# EAGLE design nas (EAGLE 7.7.0)

## Sheet 1 of 4: Power
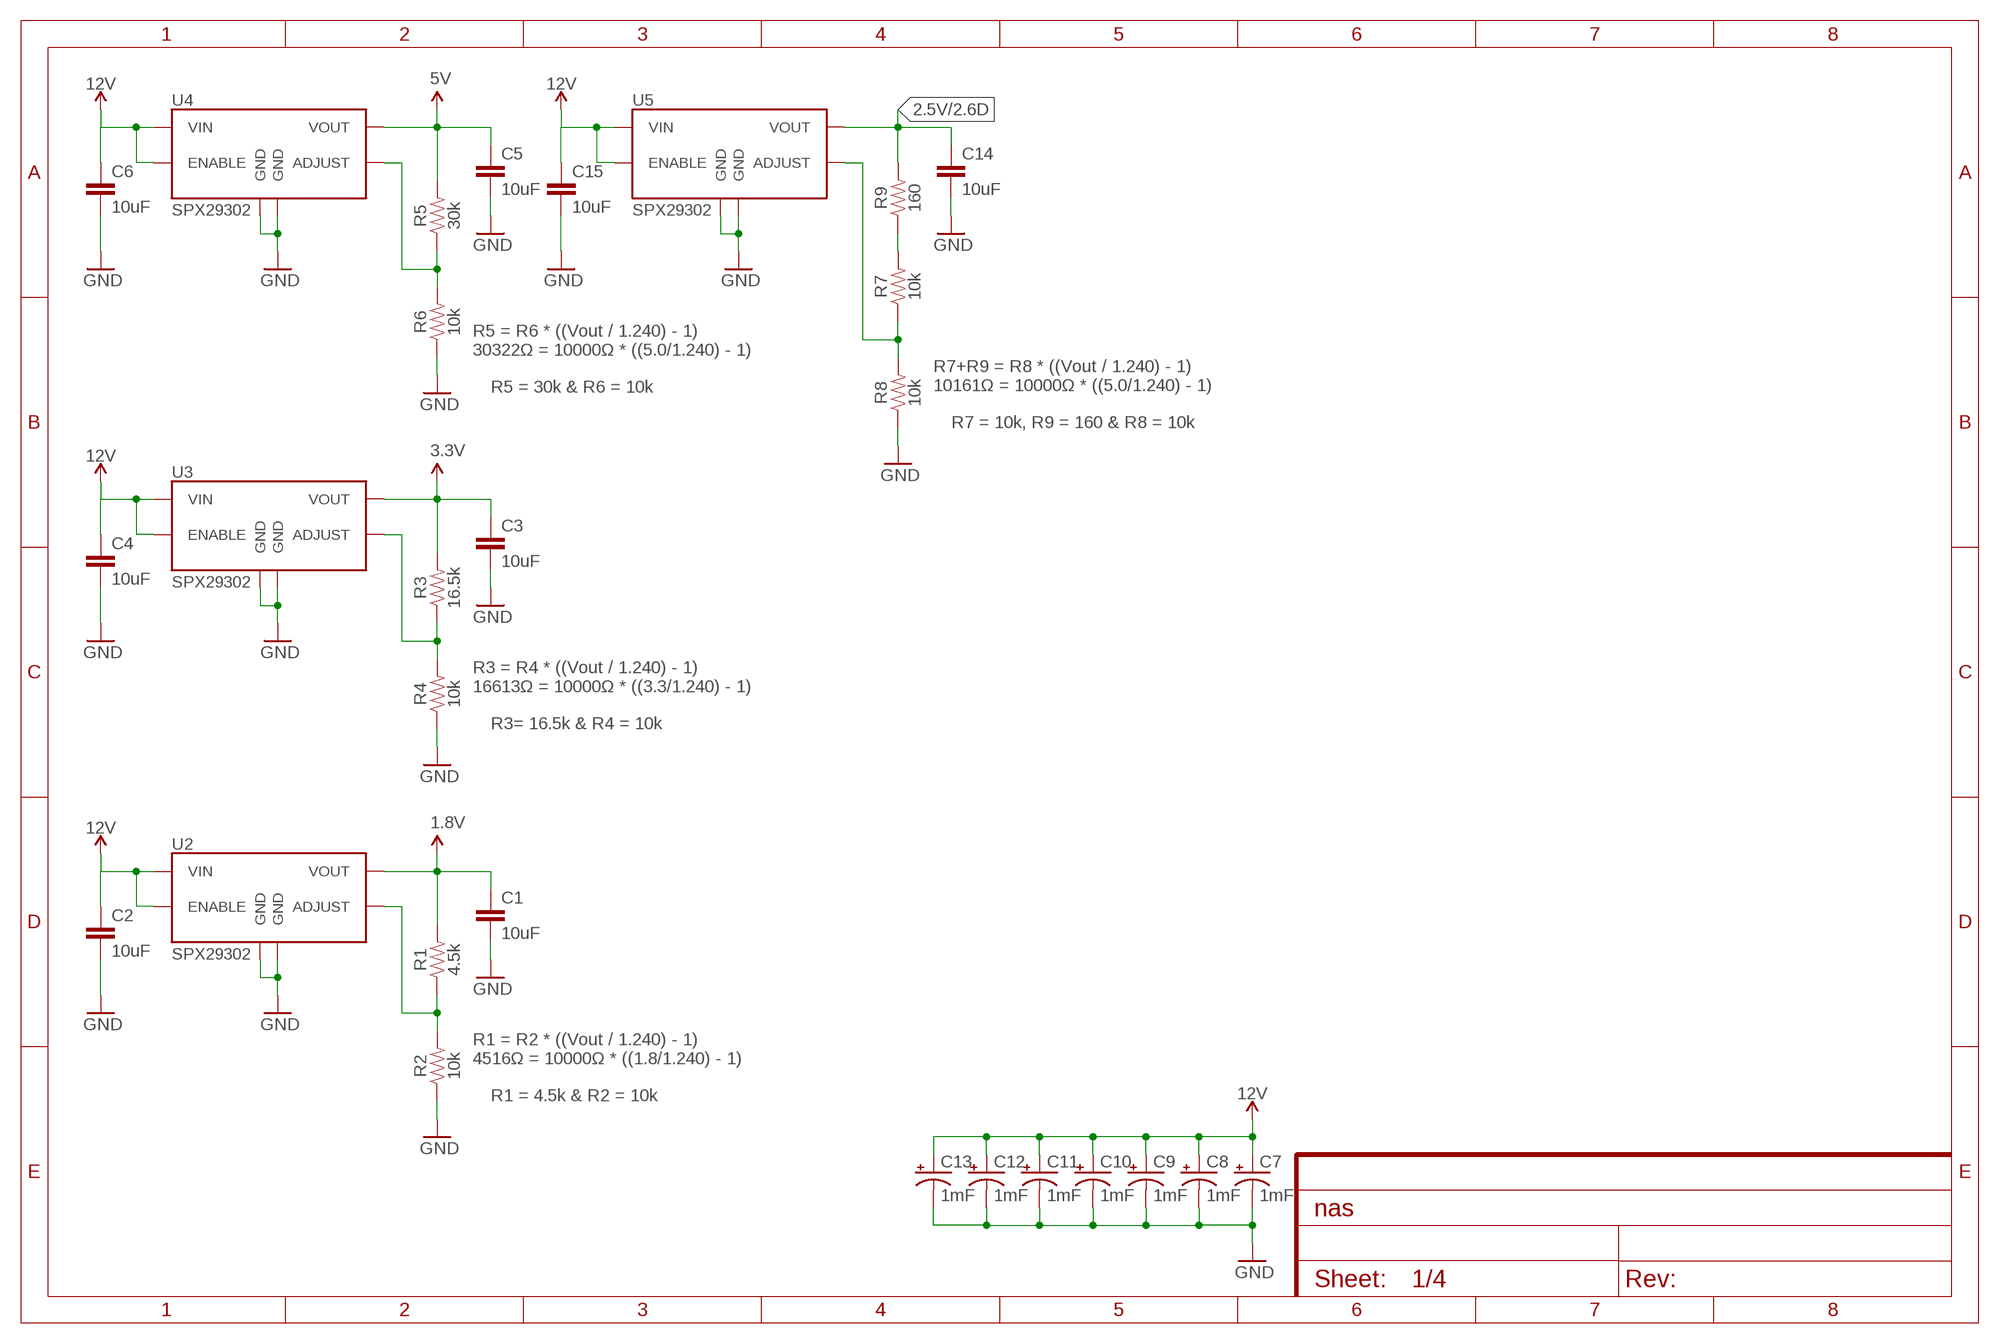
[diagram p0: schematic, sheet 1]

### Parts
C1  10uF  10UF-1206-6.3V-20%  [1206]
C2  10uF  10UF-1206-6.3V-20%  [1206]
C3  10uF  10UF-1206-6.3V-20%  [1206]
C4  10uF  10UF-1206-6.3V-20%  [1206]
C5  10uF  10UF-1206-6.3V-20%  [1206]
C6  10uF  10UF-1206-6.3V-20%  [1206]
C7  1mF  1000UF-RADIAL-5MM-25V-20%  [CPOL-RADIAL-5MM-10MM]
C8  1mF  1000UF-RADIAL-5MM-25V-20%  [CPOL-RADIAL-5MM-10MM]
C9  1mF  1000UF-RADIAL-5MM-25V-20%  [CPOL-RADIAL-5MM-10MM]
C10  1mF  1000UF-RADIAL-5MM-25V-20%  [CPOL-RADIAL-5MM-10MM]
C11  1mF  1000UF-RADIAL-5MM-25V-20%  [CPOL-RADIAL-5MM-10MM]
C12  1mF  1000UF-RADIAL-5MM-25V-20%  [CPOL-RADIAL-5MM-10MM]
C13  1mF  1000UF-RADIAL-5MM-25V-20%  [CPOL-RADIAL-5MM-10MM]
C14  10uF  10UF-1206-6.3V-20%  [1206]
C15  10uF  10UF-1206-6.3V-20%  [1206]
R1  4.5k  RESISTOR1206  [1206]
R2  10k  RESISTOR1206  [1206]
R3  16.5k  RESISTOR1206  [1206]
R4  10k  RESISTOR1206  [1206]
R5  30k  RESISTOR1206  [1206]
R6  10k  RESISTOR1206  [1206]
R7  10k  RESISTOR1206  [1206]
R8  10k  RESISTOR1206  [1206]
R9  160  RESISTOR1206  [1206]
U2  SPX29302  [Q5-DD_SPX29300]
U3  SPX29302  [Q5-DD_SPX29300]
U4  SPX29302  [Q5-DD_SPX29300]
U5  SPX29302  [Q5-DD_SPX29300]

### Nets
1.8V: C1.1 R1.2 U2.4(VOUT) ; also sheet 2
2.5V: C14.1 R9.2 U5.4(VOUT) ; also sheet 2
3.3V: C3.1 R3.2 U3.4(VOUT) ; also sheet 2
5V: C5.1 R5.2 U4.4(VOUT) ; also sheet 2,3,4
12V: C2.1 C4.1 C6.1 C7.+ C8.+ C9.+ C10.+ C11.+ C12.+ C13.+ C15.1 U2.1(ENABLE) U2.2(VIN) U3.1(ENABLE) U3.2(VIN) U4.1(ENABLE) U4.2(VIN) U5.1(ENABLE) U5.2(VIN) ; also sheet 4
ADJUST: R1.1 R2.2 U2.5(ADJUST)
ADJUST1: R3.1 R4.2 U3.5(ADJUST)
ADJUST2: R5.1 R6.2 U4.5(ADJUST)
ADJUST3: R7.1 R8.2 U5.5(ADJUST)
GND: C1.2 C2.2 C3.2 C4.2 C5.2 C6.2 C7.- C8.- C9.- C10.- C11.- C12.- C13.- C14.2 C15.2 R2.1 R4.1 R6.1 R8.1 U2.3(GND) U2.6(GND) U3.3(GND) U3.6(GND) U4.3(GND) U4.6(GND) U5.3(GND) U5.6(GND) ; also sheet 2,3,4
N$1: R7.2 R9.1

### Notes on the sheet
- R5 = R6 * ((Vout / 1.240) - 1)
  30322Ω = 10000Ω * ((5.0/1.240) - 1)
  
  ∴ R5 = 30k & R6 = 10k
- R7+R9 = R8 * ((Vout / 1.240) - 1)
  10161Ω = 10000Ω * ((5.0/1.240) - 1)
  
  ∴ R7 = 10k, R9 = 160 & R8 = 10k
- R3 = R4 * ((Vout / 1.240) - 1)
  16613Ω = 10000Ω * ((3.3/1.240) - 1)
  
  ∴ R3= 16.5k & R4 = 10k
- R1 = R2 * ((Vout / 1.240) - 1)
  4516Ω = 10000Ω * ((1.8/1.240) - 1)
  
  ∴ R1 = 4.5k & R2 = 10k

## Sheet 2 of 4: Raspberry Pi Interface
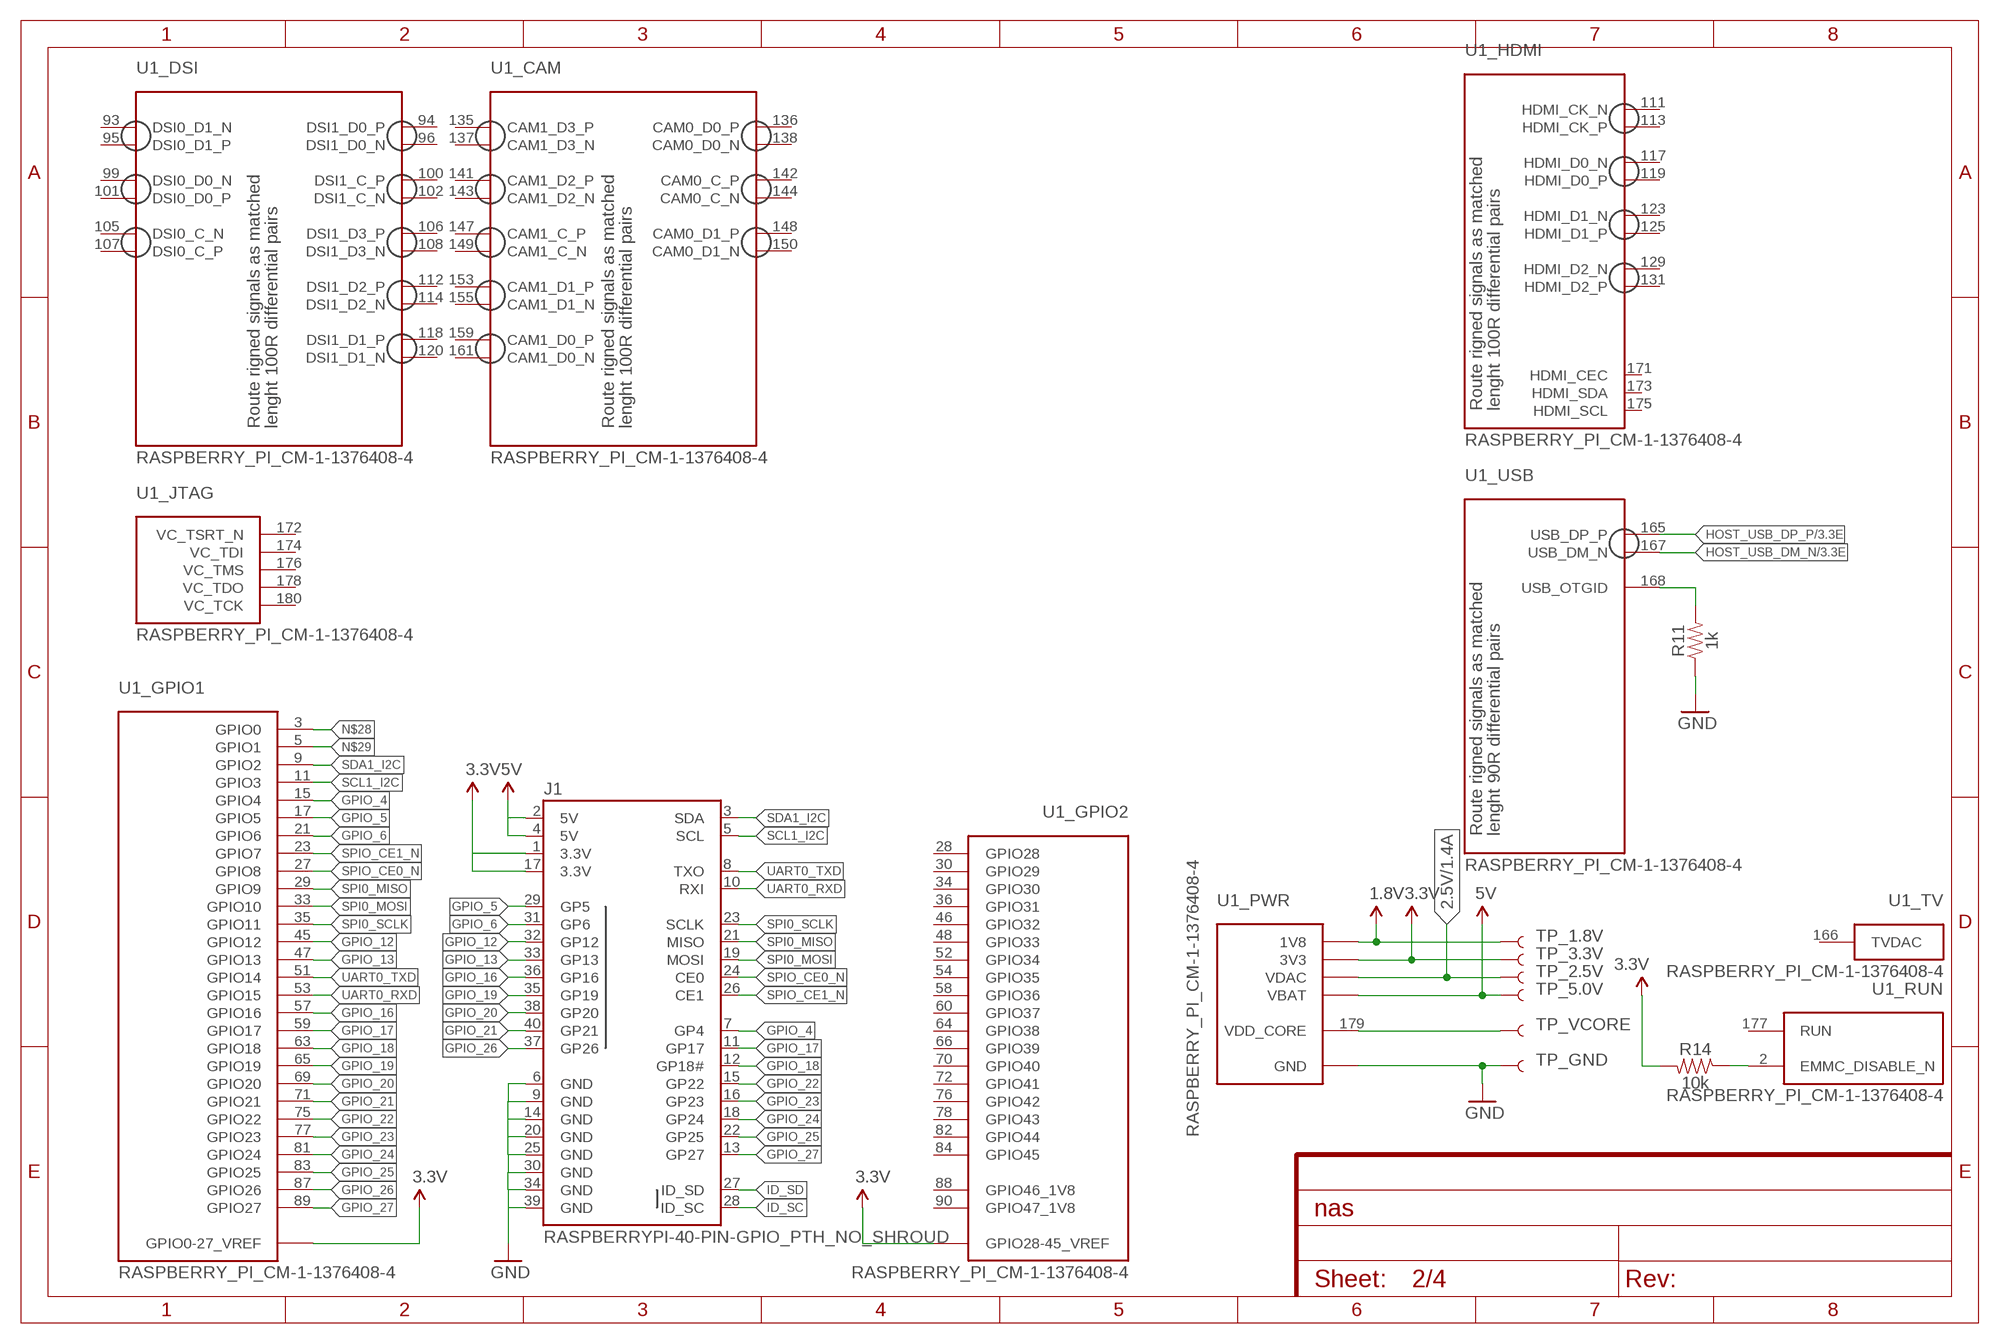
[diagram p1: schematic, sheet 2]

### Parts
J1  RASPBERRYPI-40-PIN-GPIO_PTH_NO_SHROUD  [2X20]
R11  1k  RESISTOR1206  [1206]
R14  10k  RESISTOR1206  [1206]
TP_1.8V  TEST-POINT2  [PAD.02X.02]
TP_2.5V  TEST-POINT2  [PAD.02X.02]
TP_3.3V  TEST-POINT2  [PAD.02X.02]
TP_5.0V  TEST-POINT2  [PAD.02X.02]
TP_GND  TEST-POINT2  [PAD.02X.02]
TP_VCORE  TEST-POINT2  [PAD.02X.02]
U1  RASPBERRY_PI_CM-1-1376408-4  [1-1376408-4]

### Nets
1.8V: TP_1.8V.P$1 U1.183(_PWR:1V8) U1.184(_PWR:1V8) U1.185(_PWR:1V8) U1.186(_PWR:1V8) ; also sheet 1
2.5V: TP_2.5V.P$1 U1.189(_PWR:VDAC) U1.190(_PWR:VDAC) ; also sheet 1
3.3V: J1.1(3.3V) J1.17(3.3V) R14.2 TP_3.3V.P$1 U1.39(_GPIO1:GPIO0-27_VREF) U1.40(_GPIO1:GPIO0-27_VREF) U1.41(_GPIO2:GPIO28-45_VREF) U1.42(_GPIO2:GPIO28-45_VREF) U1.191(_PWR:3V3) U1.192(_PWR:3V3) U1.193(_PWR:3V3) U1.194(_PWR:3V3) ; also sheet 1
5V: J1.2(5V) J1.4(5V) TP_5.0V.P$1 U1.197(_PWR:VBAT) U1.198(_PWR:VBAT) U1.199(_PWR:VBAT) U1.200(_PWR:VBAT) ; also sheet 1,3,4
GND: J1.6(GND) J1.9(GND) J1.14(GND) J1.20(GND) J1.25(GND) J1.30(GND) J1.34(GND) J1.39(GND) R11.1 TP_GND.P$1 U1.1(_PWR:GND) U1.7(_PWR:GND) U1.13(_PWR:GND) U1.19(_PWR:GND) U1.25(_PWR:GND) U1.26(_PWR:GND) U1.31(_PWR:GND) U1.32(_PWR:GND) U1.37(_PWR:GND) U1.38(_PWR:GND) U1.43(_PWR:GND) U1.44(_PWR:GND) U1.49(_PWR:GND) U1.50(_PWR:GND) U1.55(_PWR:GND) U1.56(_PWR:GND) U1.61(_PWR:GND) U1.62(_PWR:GND) U1.67(_PWR:GND) U1.68(_PWR:GND) U1.73(_PWR:GND) U1.74(_PWR:GND) U1.79(_PWR:GND) U1.80(_PWR:GND) U1.85(_PWR:GND) U1.86(_PWR:GND) U1.91(_PWR:GND) U1.92(_PWR:GND) U1.97(_PWR:GND) U1.98(_PWR:GND) U1.103(_PWR:GND) U1.104(_PWR:GND) U1.109(_PWR:GND) U1.110(_PWR:GND) U1.115(_PWR:GND) U1.116(_PWR:GND) U1.121(_PWR:GND) U1.122(_PWR:GND) U1.127(_PWR:GND) U1.133(_PWR:GND) U1.134(_PWR:GND) U1.139(_PWR:GND) U1.140(_PWR:GND) U1.145(_PWR:GND) U1.146(_PWR:GND) U1.151(_PWR:GND) U1.152(_PWR:GND) U1.157(_PWR:GND) U1.163(_PWR:GND) U1.164(_PWR:GND) U1.169(_PWR:GND) U1.170(_PWR:GND) U1.181(_PWR:GND) U1.182(_PWR:GND) U1.187(_PWR:GND) U1.188(_PWR:GND) U1.195(_PWR:GND) U1.196(_PWR:GND) ; also sheet 1,3,4
GPIO_4: J1.7(GP4) U1.15(_GPIO1:GPIO4)
GPIO_5: J1.29(GP5) U1.17(_GPIO1:GPIO5)
GPIO_6: J1.31(GP6) U1.21(_GPIO1:GPIO6)
GPIO_12: J1.32(GP12) U1.45(_GPIO1:GPIO12)
GPIO_13: J1.33(GP13) U1.47(_GPIO1:GPIO13)
GPIO_16: J1.36(GP16) U1.57(_GPIO1:GPIO16)
GPIO_17: J1.11(GP17) U1.59(_GPIO1:GPIO17)
GPIO_18: J1.12(GP18#) U1.63(_GPIO1:GPIO18)
GPIO_19: J1.35(GP19) U1.65(_GPIO1:GPIO19)
GPIO_20: J1.38(GP20) U1.69(_GPIO1:GPIO20)
GPIO_21: J1.40(GP21) U1.71(_GPIO1:GPIO21)
GPIO_22: J1.15(GP22) U1.75(_GPIO1:GPIO22)
GPIO_23: J1.16(GP23) U1.77(_GPIO1:GPIO23)
GPIO_24: J1.18(GP24) U1.81(_GPIO1:GPIO24)
GPIO_25: J1.22(GP25) U1.83(_GPIO1:GPIO25)
GPIO_26: J1.37(GP26) U1.87(_GPIO1:GPIO26)
GPIO_27: J1.13(GP27) U1.89(_GPIO1:GPIO27)
HOST_USB_DM_N: U1.167(_USB:USB_DM_N) ; also sheet 3
HOST_USB_DP_P: U1.165(_USB:USB_DP_P) ; also sheet 3
ID_SC: J1.28(ID_SC)
ID_SD: J1.27(ID_SD)
N$2: TP_VCORE.P$1 U1.179(_PWR:VDD_CORE)
N$22: R11.2 U1.168(_USB:USB_OTGID)
N$27: R14.1 U1.2(_RUN:EMMC_DISABLE_N)
N$28: U1.3(_GPIO1:GPIO0)
N$29: U1.5(_GPIO1:GPIO1)
SCL1_I2C: J1.5(SCL) U1.11(_GPIO1:GPIO3)
SDA1_I2C: J1.3(SDA) U1.9(_GPIO1:GPIO2)
SPI0_MISO: J1.21(MISO) U1.29(_GPIO1:GPIO9)
SPI0_MOSI: J1.19(MOSI) U1.33(_GPIO1:GPIO10)
SPI0_SCLK: J1.23(SCLK) U1.35(_GPIO1:GPIO11)
SPIO_CE0_N: J1.24(CE0) U1.27(_GPIO1:GPIO8)
SPIO_CE1_N: J1.26(CE1) U1.23(_GPIO1:GPIO7)
UART0_RXD: J1.10(RXI) U1.53(_GPIO1:GPIO15)
UART0_TXD: J1.8(TXO) U1.51(_GPIO1:GPIO14)
Unconnected: U1.28(_GPIO2:GPIO28) U1.30(_GPIO2:GPIO29) U1.34(_GPIO2:GPIO30) U1.36(_GPIO2:GPIO31) U1.46(_GPIO2:GPIO32) U1.48(_GPIO2:GPIO33) U1.52(_GPIO2:GPIO34) U1.54(_GPIO2:GPIO35) U1.58(_GPIO2:GPIO36) U1.60(_GPIO2:GPIO37) U1.64(_GPIO2:GPIO38) U1.66(_GPIO2:GPIO39) U1.70(_GPIO2:GPIO40) U1.72(_GPIO2:GPIO41) U1.76(_GPIO2:GPIO42) U1.78(_GPIO2:GPIO43) U1.82(_GPIO2:GPIO44) U1.84(_GPIO2:GPIO45) U1.88(_GPIO2:GPIO46_1V8) U1.90(_GPIO2:GPIO47_1V8) U1.93(_DSI:DSI0_D1_N) U1.94(_DSI:DSI1_D0_P) U1.95(_DSI:DSI0_D1_P) U1.96(_DSI:DSI1_D0_N) U1.99(_DSI:DSI0_D0_N) U1.100(_DSI:DSI1_C_P) U1.101(_DSI:DSI0_D0_P) U1.102(_DSI:DSI1_C_N) U1.105(_DSI:DSI0_C_N) U1.106(_DSI:DSI1_D3_P) U1.107(_DSI:DSI0_C_P) U1.108(_DSI:DSI1_D3_N) U1.111(_HDMI:HDMI_CK_N) U1.112(_DSI:DSI1_D2_P) U1.113(_HDMI:HDMI_CK_P) U1.114(_DSI:DSI1_D2_N) U1.117(_HDMI:HDMI_D0_N) U1.118(_DSI:DSI1_D1_P) U1.119(_HDMI:HDMI_D0_P) U1.120(_DSI:DSI1_D1_N) U1.123(_HDMI:HDMI_D1_N) U1.125(_HDMI:HDMI_D1_P) U1.129(_HDMI:HDMI_D2_N) U1.131(_HDMI:HDMI_D2_P) U1.135(_CAM:CAM1_D3_P) U1.136(_CAM:CAM0_D0_P) U1.137(_CAM:CAM1_D3_N) U1.138(_CAM:CAM0_D0_N) U1.141(_CAM:CAM1_D2_P) U1.142(_CAM:CAM0_C_P) U1.143(_CAM:CAM1_D2_N) U1.144(_CAM:CAM0_C_N) U1.147(_CAM:CAM1_C_P) U1.148(_CAM:CAM0_D1_P) U1.149(_CAM:CAM1_C_N) U1.150(_CAM:CAM0_D1_N) U1.153(_CAM:CAM1_D1_P) U1.155(_CAM:CAM1_D1_N) U1.159(_CAM:CAM1_D0_P) U1.161(_CAM:CAM1_D0_N) U1.166(_TV:TVDAC) U1.171(_HDMI:HDMI_CEC) U1.172(_JTAG:VC_TSRT_N) U1.173(_HDMI:HDMI_SDA) U1.174(_JTAG:VC_TDI) U1.175(_HDMI:HDMI_SCL) U1.176(_JTAG:VC_TMS) U1.177(_RUN:RUN) U1.178(_JTAG:VC_TDO) U1.180(_JTAG:VC_TCK)

## Sheet 3 of 4: USB Hubs
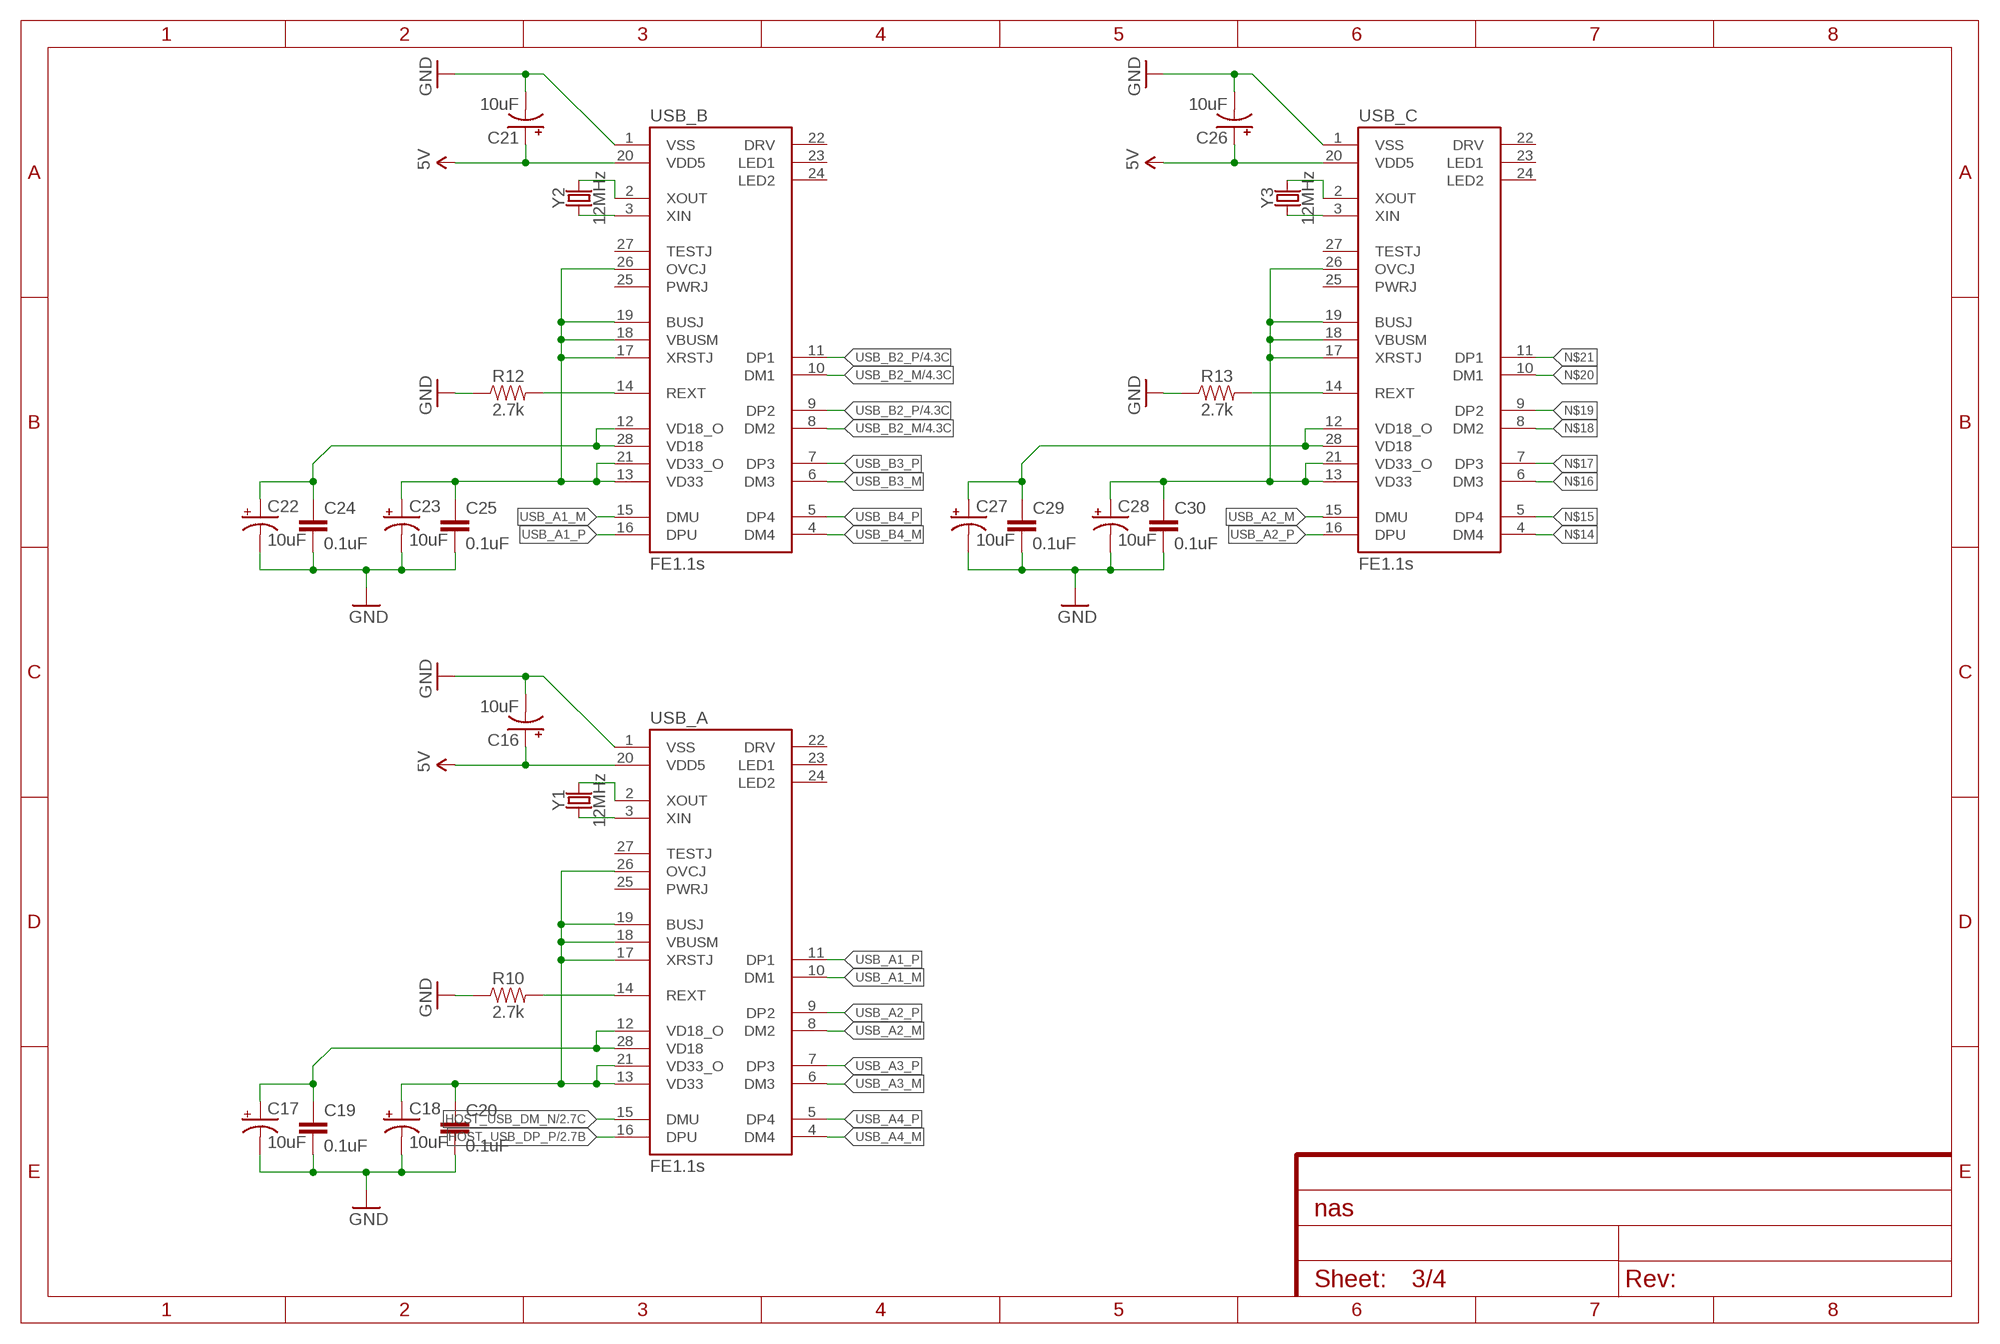
[diagram p2: schematic, sheet 3]

### Parts
C16  10uF  10UF-POLAR-EIA3216-16V-10%(TANT)  [EIA3216]
C17  10uF  10UF-POLAR-EIA3216-16V-10%(TANT)  [EIA3216]
C18  10uF  10UF-POLAR-EIA3216-16V-10%(TANT)  [EIA3216]
C19  0.1uF  10UF-1206-6.3V-20%  [1206]
C20  0.1uF  10UF-1206-6.3V-20%  [1206]
C21  10uF  10UF-POLAR-EIA3216-16V-10%(TANT)  [EIA3216]
C22  10uF  10UF-POLAR-EIA3216-16V-10%(TANT)  [EIA3216]
C23  10uF  10UF-POLAR-EIA3216-16V-10%(TANT)  [EIA3216]
C24  0.1uF  10UF-1206-6.3V-20%  [1206]
C25  0.1uF  10UF-1206-6.3V-20%  [1206]
C26  10uF  10UF-POLAR-EIA3216-16V-10%(TANT)  [EIA3216]
C27  10uF  10UF-POLAR-EIA3216-16V-10%(TANT)  [EIA3216]
C28  10uF  10UF-POLAR-EIA3216-16V-10%(TANT)  [EIA3216]
C29  0.1uF  10UF-1206-6.3V-20%  [1206]
C30  0.1uF  10UF-1206-6.3V-20%  [1206]
R10  2.7k  RESISTOR1206  [1206]
R12  2.7k  RESISTOR1206  [1206]
R13  2.7k  RESISTOR1206  [1206]
USB_A  FE1.1S  [FE1.1S_SSOP-28]
USB_B  FE1.1S  [FE1.1S_SSOP-28]
USB_C  FE1.1S  [FE1.1S_SSOP-28]
Y1  12MHz  CRYSTAL-12MHZ"  [CRYSTAL-SMD-5X3.2-4PAD]
Y2  12MHz  CRYSTAL-12MHZ"  [CRYSTAL-SMD-5X3.2-4PAD]
Y3  12MHz  CRYSTAL-12MHZ"  [CRYSTAL-SMD-5X3.2-4PAD]

### Nets
5V: C16.+ C21.+ C26.+ USB_A.20(VDD5) USB_B.20(VDD5) USB_C.20(VDD5) ; also sheet 1,2,4
GND: C16.- C17.- C18.- C19.2 C20.2 C21.- C22.- C23.- C24.2 C25.2 C26.- C27.- C28.- C29.2 C30.2 R10.1 R12.1 R13.1 USB_A.1(VSS) USB_B.1(VSS) USB_C.1(VSS) ; also sheet 1,2,4
HOST_USB_DM_N: USB_A.15(DMU) ; also sheet 2
HOST_USB_DP_P: USB_A.16(DPU) ; also sheet 2
N$3: C17.+ C19.1 USB_A.12(VD18_O) USB_A.28(VD18)
N$4: C18.+ C20.1 USB_A.13(VD33) USB_A.17(XRSTJ) USB_A.18(VBUSM) USB_A.19(BUSJ) USB_A.21(VD33_O) USB_A.26(OVCJ)
N$5: USB_B.3(XIN) Y2.1
N$6: USB_A.3(XIN) Y1.1
N$7: USB_A.2(XOUT) Y1.3
N$8: USB_B.2(XOUT) Y2.3
N$9: C22.+ C24.1 USB_B.12(VD18_O) USB_B.28(VD18)
N$10: C23.+ C25.1 USB_B.13(VD33) USB_B.17(XRSTJ) USB_B.18(VBUSM) USB_B.19(BUSJ) USB_B.21(VD33_O) USB_B.26(OVCJ)
N$11: R10.2 USB_A.14(REXT)
N$12: R12.2 USB_B.14(REXT)
N$13: USB_C.3(XIN) Y3.1
N$14: USB_C.4(DM4)
N$15: USB_C.5(DP4)
N$16: USB_C.6(DM3)
N$17: USB_C.7(DP3)
N$18: USB_C.8(DM2)
N$19: USB_C.9(DP2)
N$20: USB_C.10(DM1)
N$21: USB_C.11(DP1)
N$23: USB_C.2(XOUT) Y3.3
N$24: C27.+ C29.1 USB_C.12(VD18_O) USB_C.28(VD18)
N$25: C28.+ C30.1 USB_C.13(VD33) USB_C.17(XRSTJ) USB_C.18(VBUSM) USB_C.19(BUSJ) USB_C.21(VD33_O) USB_C.26(OVCJ)
N$26: R13.2 USB_C.14(REXT)
USB_A1_M: USB_A.10(DM1) USB_B.15(DMU)
USB_A1_P: USB_A.11(DP1) USB_B.16(DPU)
USB_A2_M: USB_A.8(DM2) USB_C.15(DMU)
USB_A2_P: USB_A.9(DP2) USB_C.16(DPU)
USB_A3_M: USB_A.6(DM3)
USB_A3_P: USB_A.7(DP3)
USB_A4_M: USB_A.4(DM4)
USB_A4_P: USB_A.5(DP4)
USB_B2_M: USB_B.8(DM2) USB_B.10(DM1) ; also sheet 4
USB_B2_P: USB_B.9(DP2) USB_B.11(DP1) ; also sheet 4
USB_B3_M: USB_B.6(DM3)
USB_B3_P: USB_B.7(DP3)
USB_B4_M: USB_B.4(DM4)
USB_B4_P: USB_B.5(DP4)
Unconnected: USB_A.22(DRV) USB_A.23(LED1) USB_A.24(LED2) USB_A.25(PWRJ) USB_A.27(TESTJ) USB_B.22(DRV) USB_B.23(LED1) USB_B.24(LED2) USB_B.25(PWRJ) USB_B.27(TESTJ) USB_C.22(DRV) USB_C.23(LED1) USB_C.24(LED2) USB_C.25(PWRJ) USB_C.27(TESTJ)

## Sheet 4 of 4: SATA 1&2
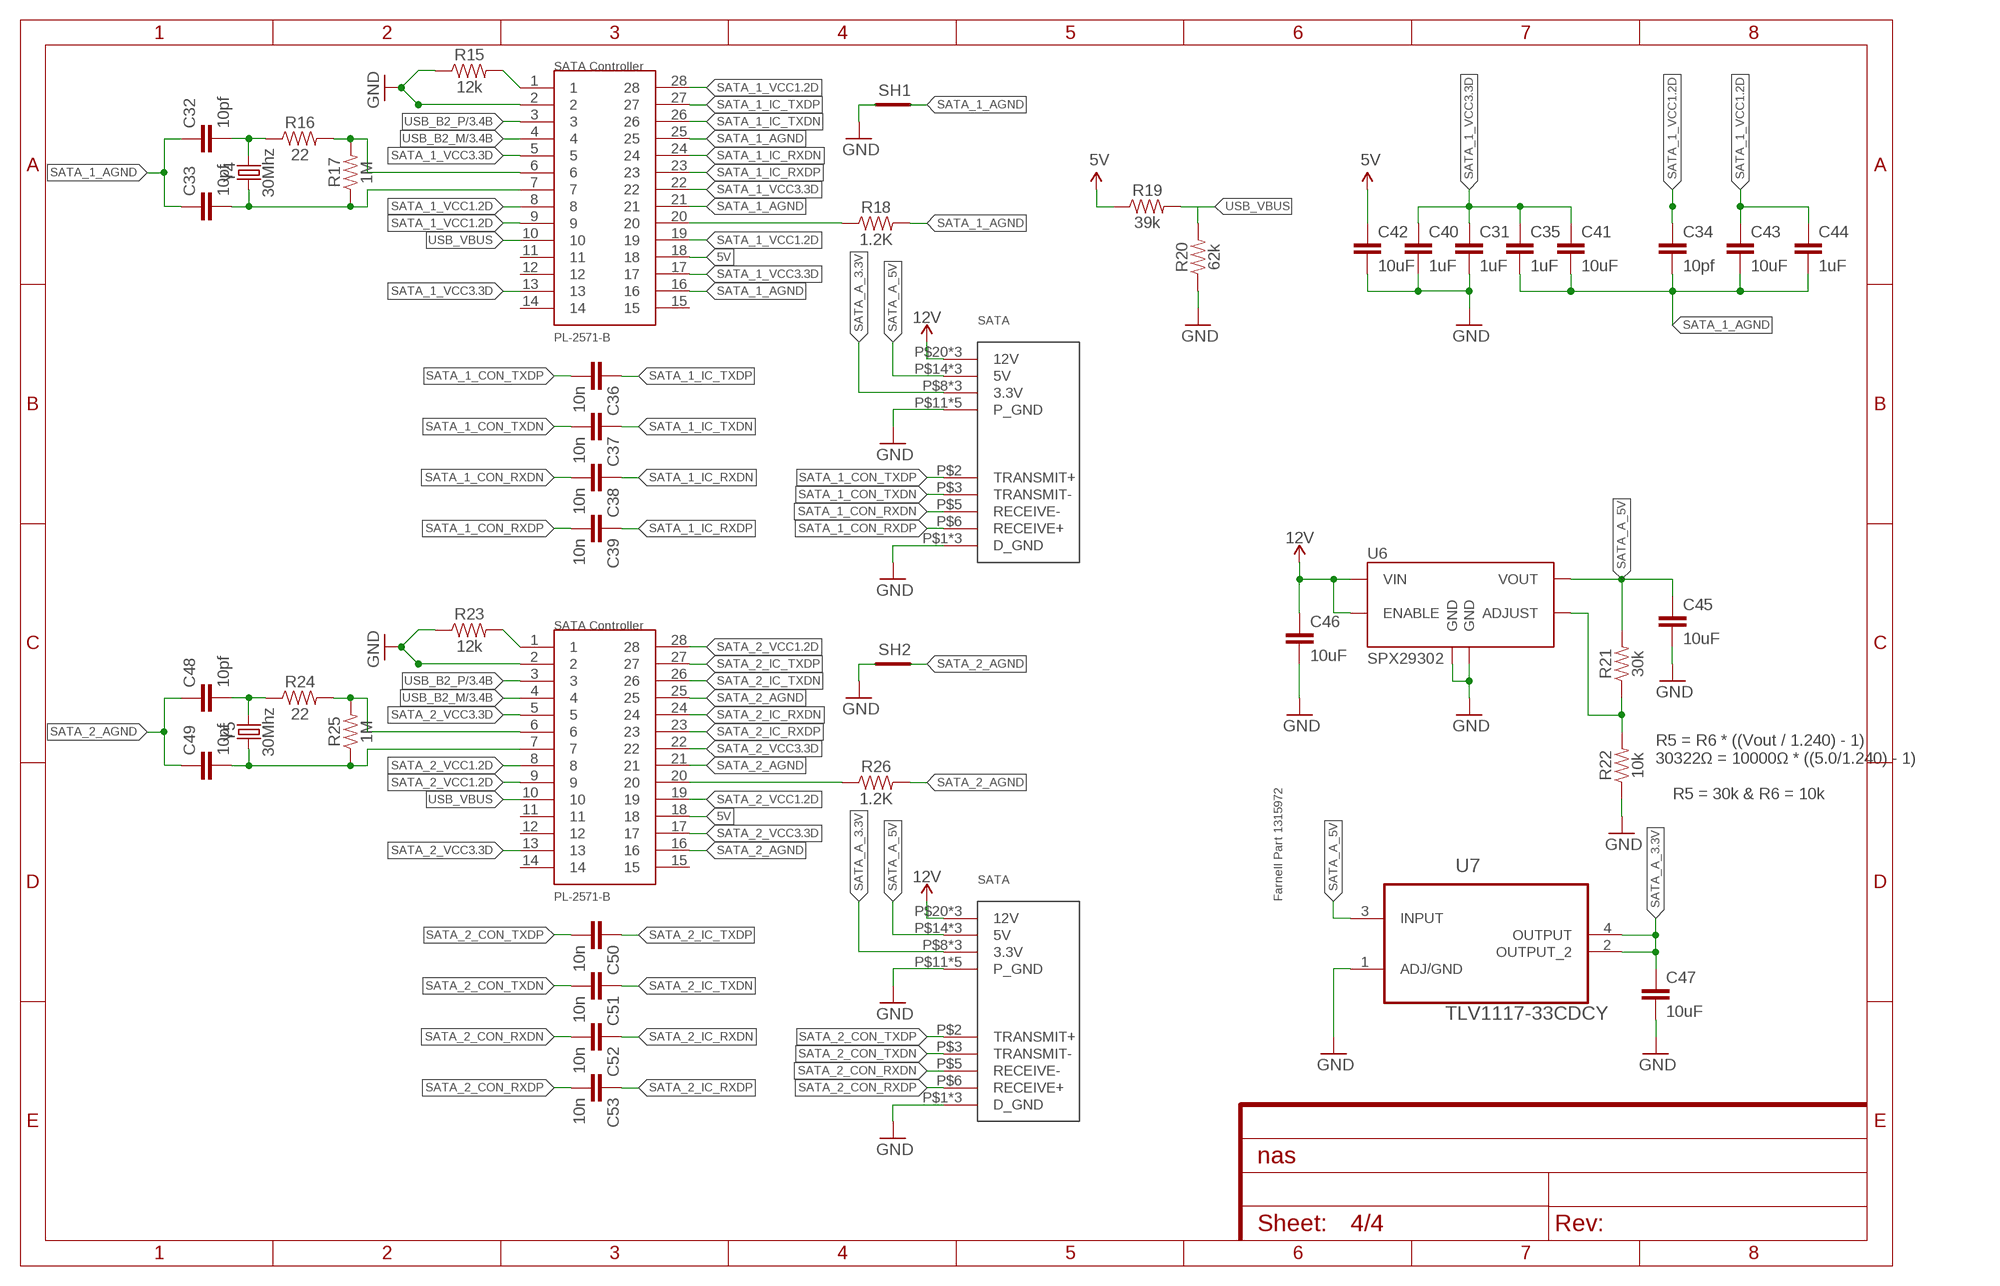
[diagram p3: schematic, sheet 4]

### Parts
C31  1uF  10UF-1206-6.3V-20%  [1206]
C32  10pf  10UF-1206-6.3V-20%  [1206]
C33  10pf  10UF-1206-6.3V-20%  [1206]
C34  10pf  10UF-1206-6.3V-20%  [1206]
C35  1uF  10UF-1206-6.3V-20%  [1206]
C36  10n  10UF-1206-6.3V-20%  [1206]
C37  10n  10UF-1206-6.3V-20%  [1206]
C38  10n  10UF-1206-6.3V-20%  [1206]
C39  10n  10UF-1206-6.3V-20%  [1206]
C40  1uF  10UF-1206-6.3V-20%  [1206]
C41  10uF  10UF-1206-6.3V-20%  [1206]
C42  10uF  10UF-1206-6.3V-20%  [1206]
C43  10uF  10UF-1206-6.3V-20%  [1206]
C44  1uF  10UF-1206-6.3V-20%  [1206]
C45  10uF  10UF-1206-6.3V-20%  [1206]
C46  10uF  10UF-1206-6.3V-20%  [1206]
C47  10uF  10UF-1206-6.3V-20%  [1206]
C48  10pf  10UF-1206-6.3V-20%  [1206]
C49  10pf  10UF-1206-6.3V-20%  [1206]
C50  10n  10UF-1206-6.3V-20%  [1206]
C51  10n  10UF-1206-6.3V-20%  [1206]
C52  10n  10UF-1206-6.3V-20%  [1206]
C53  10n  10UF-1206-6.3V-20%  [1206]
R15  12k  RESISTOR1206  [1206]
R16  22  RESISTOR1206  [1206]
R17  1M  RESISTOR1206  [1206]
R18  1.2K  RESISTOR1206  [1206]
R19  39k  RESISTOR1206  [1206]
R20  62k  RESISTOR1206  [1206]
R21  30k  RESISTOR1206  [1206]
R22  10k  RESISTOR1206  [1206]
R23  12k  RESISTOR1206  [1206]
R24  22  RESISTOR1206  [1206]
R25  1M  RESISTOR1206  [1206]
R26  1.2K  RESISTOR1206  [1206]
SH1  SHORT-HT5  [SHORT_TOP-50]
SH2  SHORT-HT5  [SHORT_TOP-50]
U6  SPX29302  [Q5-DD_SPX29300]
U7  TLV1117-33CDCY  [SOT230P700X180-4N]
U$12  PL-2571-B  SSOP28  [SSOP28DB]
U$15  SATA_POWER_AND_DATA  [3M-SATA-5622-1200-ML]
U$16  PL-2571-B  SSOP28  [SSOP28DB]
U$17  SATA_POWER_AND_DATA  [3M-SATA-5622-1200-ML]
Y4  30Mhz  CRYSTAL-12MHZ"  [CRYSTAL-SMD-5X3.2-4PAD]
Y5  30Mhz  CRYSTAL-12MHZ"  [CRYSTAL-SMD-5X3.2-4PAD]

### Nets
5V: C42.1 R19.1 U$12.18 U$16.18 ; also sheet 1,2,3
12V: C46.1 U6.1(ENABLE) U6.2(VIN) U$15.P$20(12V) U$15.P$21(12V) U$15.P$22(12V) U$17.P$20(12V) U$17.P$21(12V) U$17.P$22(12V) ; also sheet 1
ADJUST4: R21.1 R22.2 U6.5(ADJUST)
GND: C31.2 C40.2 C42.2 C45.2 C46.2 C47.2 R15.1 R20.1 R22.1 R23.1 SH1.1 SH2.1 U6.3(GND) U6.6(GND) U7.1(ADJ/GND) U$12.2 U$15.P$1(D_GND) U$15.P$4(D_GND) U$15.P$7(D_GND) U$15.P$11(P_GND) U$15.P$12(P_GND) U$15.P$13(P_GND) U$15.P$17(P_GND) U$15.P$19(P_GND) U$16.2 U$17.P$1(D_GND) U$17.P$4(D_GND) U$17.P$7(D_GND) U$17.P$11(P_GND) U$17.P$12(P_GND) U$17.P$13(P_GND) U$17.P$17(P_GND) U$17.P$19(P_GND) ; also sheet 1,2,3
N$30: R23.2 U$16.1
N$31: R15.2 U$12.1
N$32: R18.1 U$12.20
N$33: C49.2 R25.1 U$16.7 Y5.1
N$34: R24.2 R25.2 U$16.6
N$35: C48.2 R24.1 Y5.3
N$36: R26.1 U$16.20
N$40: C33.2 R17.1 U$12.7 Y4.1
N$41: R16.2 R17.2 U$12.6
N$42: C32.2 R16.1 Y4.3
SATA_1_AGND: C32.1 C33.1 C34.2 C35.2 C41.2 C43.2 C44.2 R18.2 SH1.2 U$12.16 U$12.21 U$12.25
SATA_1_CON_RXDN: C38.2 U$15.P$5(RECEIVE-)
SATA_1_CON_RXDP: C39.2 U$15.P$6(RECEIVE+)
SATA_1_CON_TXDN: C37.2 U$15.P$3(TRANSMIT-)
SATA_1_CON_TXDP: C36.2 U$15.P$2(TRANSMIT+)
SATA_1_IC_RXDN: C38.1 U$12.24
SATA_1_IC_RXDP: C39.1 U$12.23
SATA_1_IC_TXDN: C37.1 U$12.26
SATA_1_IC_TXDP: C36.1 U$12.27
SATA_1_VCC1.2D: C34.1 C43.1 C44.1 U$12.8 U$12.9 U$12.19 U$12.28
SATA_1_VCC3.3D: C31.1 C35.1 C40.1 C41.1 U$12.5 U$12.13 U$12.17 U$12.22
SATA_2_AGND: C48.1 C49.1 R26.2 SH2.2 U$16.16 U$16.21 U$16.25
SATA_2_CON_RXDN: C52.2 U$17.P$5(RECEIVE-)
SATA_2_CON_RXDP: C53.2 U$17.P$6(RECEIVE+)
SATA_2_CON_TXDN: C51.2 U$17.P$3(TRANSMIT-)
SATA_2_CON_TXDP: C50.2 U$17.P$2(TRANSMIT+)
SATA_2_IC_RXDN: C52.1 U$16.24
SATA_2_IC_RXDP: C53.1 U$16.23
SATA_2_IC_TXDN: C51.1 U$16.26
SATA_2_IC_TXDP: C50.1 U$16.27
SATA_2_VCC1.2D: U$16.8 U$16.9 U$16.19 U$16.28
SATA_2_VCC3.3D: U$16.5 U$16.13 U$16.17 U$16.22
SATA_A_3.3V: C47.1 U7.2(OUTPUT_2) U7.4(OUTPUT) U$15.P$8(3.3V) U$15.P$9(3.3V) U$15.P$10(3.3V) U$17.P$8(3.3V) U$17.P$9(3.3V) U$17.P$10(3.3V)
SATA_A_5V: C45.1 R21.2 U6.4(VOUT) U7.3(INPUT) U$15.P$14(5V) U$15.P$15(5V) U$15.P$16(5V) U$17.P$14(5V) U$17.P$15(5V) U$17.P$16(5V)
USB_B2_M: U$12.4 U$16.4 ; also sheet 3
USB_B2_P: U$12.3 U$16.3 ; also sheet 3
USB_VBUS: R19.2 R20.2 U$12.10 U$16.10
Unconnected: U$12.11 U$12.12 U$12.14 U$12.15 U$16.11 U$16.12 U$16.14 U$16.15

### Notes on the sheet
- SATA Controller
- PL-2571-B
- SATA Controller
- R5 = R6 * ((Vout / 1.240) - 1)
  30322Ω = 10000Ω * ((5.0/1.240) - 1)
  
  ∴ R5 = 30k & R6 = 10k
- PL-2571-B | Farnell Part 1315972

## Library data of the parts
C1-C6 C14 C15 C41-C43 C45-C47 = SparkFun-Capacitors:10UF: 10.0µF ceramic capacitors A capacitor is a passive two-terminal electrical component used to store electrical energy temporarily in an electric field.; PROD_ID: CAP-10057
C7-C13 = SparkFun-Capacitors:1000UF: 1,000µF/1mF ceramic capacitors A capacitor is a passive two-terminal electrical component used to store electrical energy temporarily in an electric field. CAP-08070; PROD_ID: CAP-09538
C16-C18 C21-C23 C26-C28 = SparkFun-Capacitors:10UF-POLAR: 10.0µF polarized capacitors A capacitor is a passive two-terminal electrical component used to store electrical energy temporarily in an electric field.; PROD_ID: CAP-00811
C19 C20 C24 C25 C29-C40 C44 C48-C53 = SparkFun-Capacitors:10UF: 10.0µF ceramic capacitors A capacitor is a passive two-terminal electrical component used to store electrical energy temporarily in an electric field.; PROD_ID: CAP-10057; VALUE: 10uF
J1 = SparkFun-Connectors:RASPBERRYPI-40-PIN-GPIO: Raspberry Pi GPIO Header 2x20 pin connector, as found on B, B+, A+ models. Both shrouded PTH and SMT versions available. SparkFun Products: GPIO Shrouded Header <https://www.sparkfun.com/products/13054>- PTH SparkFun Pi Wedge (Preassembled) <https://www.sparkfun.com/products/13717>
R1-R26 = SparkFun-Resistors:RESISTOR: Generic Resistor Package
SH1 SH2 = shorts-old:SHORT-H: Short between two nets; BOM: no
TP_1.8V TP_2.5V TP_3.3V TP_5.0V TP_GND TP_VCORE = SparkFun-Connectors:TEST-POINT: SparkFun Test Points Bare copper test points for troubleshooting or In-Circuit-Testing. These are used by our Production team for verifying production board runs using pogo-pins on test beds. SparkFun Products: SparkFun LSM9DS1 Breakout <https://www.sparkfun.com/products/13284> SparkFun PSOC <https://www.sparkfun.com/products/13714> SparkFun Load Cell Amplifier <https://www.sparkfun.com/products/13879>
U1 = Ciseco%20Pi%20Compute%20Module:RASPBERRY_PI_CM: Raspberry Pi Compute Module As anounced in this blog post http://www.raspberrypi.org/raspberry-pi-compute-module-new-product/ Based on infomation from this schematic http://www.raspberrypi.org/wp-content/uploads/2014/04/RPI-CM-V1_1-SCHEMATIC.pdf Footprint is unproven and no matching part confimed as of yet
U2-U6 = SparkFun-IC-Power:SPX29302: 3A LDO regulator; PROD_ID: VREG-08337
U7 = Texas Instruments_By_element14_Batch_1:TLV1117-33CDCY: V REG, LDO, 3.3V, 0.8A; MPN: TLV1117-33CDCY; OC_FARNELL: 1494942; OC_NEWARK: 67K8520; PACKAGE: SOT-223-3; SUPPLIER: TEXAS INSTRUMENTS
U$12 U$16 = SparkFun:SSOP28
U$15 U$17 = geusebio:SATA_POWER_AND_DATA: 3M Vertical SATA Power & Data connector
USB_A USB_B USB_C = imcom:FE1.1S: A USB 2.0 hub IC. http://www.jfd-ic.com/Documents/FE1.1s%20Data%20Sheet%20%28Rev.%201.0%29.pdf
Y1-Y3 = SparkFun-Clocks:CRYSTAL-12MHZ: 12.0MHz Crystal Frequency: 12.0MHz Frequency Tolerance: ±20ppm Load Capacitance: 18pF SparkFun Products: SparkFun Logomatic <https://www.sparkfun.com/products/12772> Pocket AVR Programmer <https://www.sparkfun.com/products/9825>; PROD_ID: XTAL-08297
Y4 Y5 = SparkFun-Clocks:CRYSTAL-12MHZ: 12.0MHz Crystal Frequency: 12.0MHz Frequency Tolerance: ±20ppm Load Capacitance: 18pF SparkFun Products: SparkFun Logomatic <https://www.sparkfun.com/products/12772> Pocket AVR Programmer <https://www.sparkfun.com/products/9825>; PROD_ID: XTAL-08297; VALUE: 12MHz

## Board
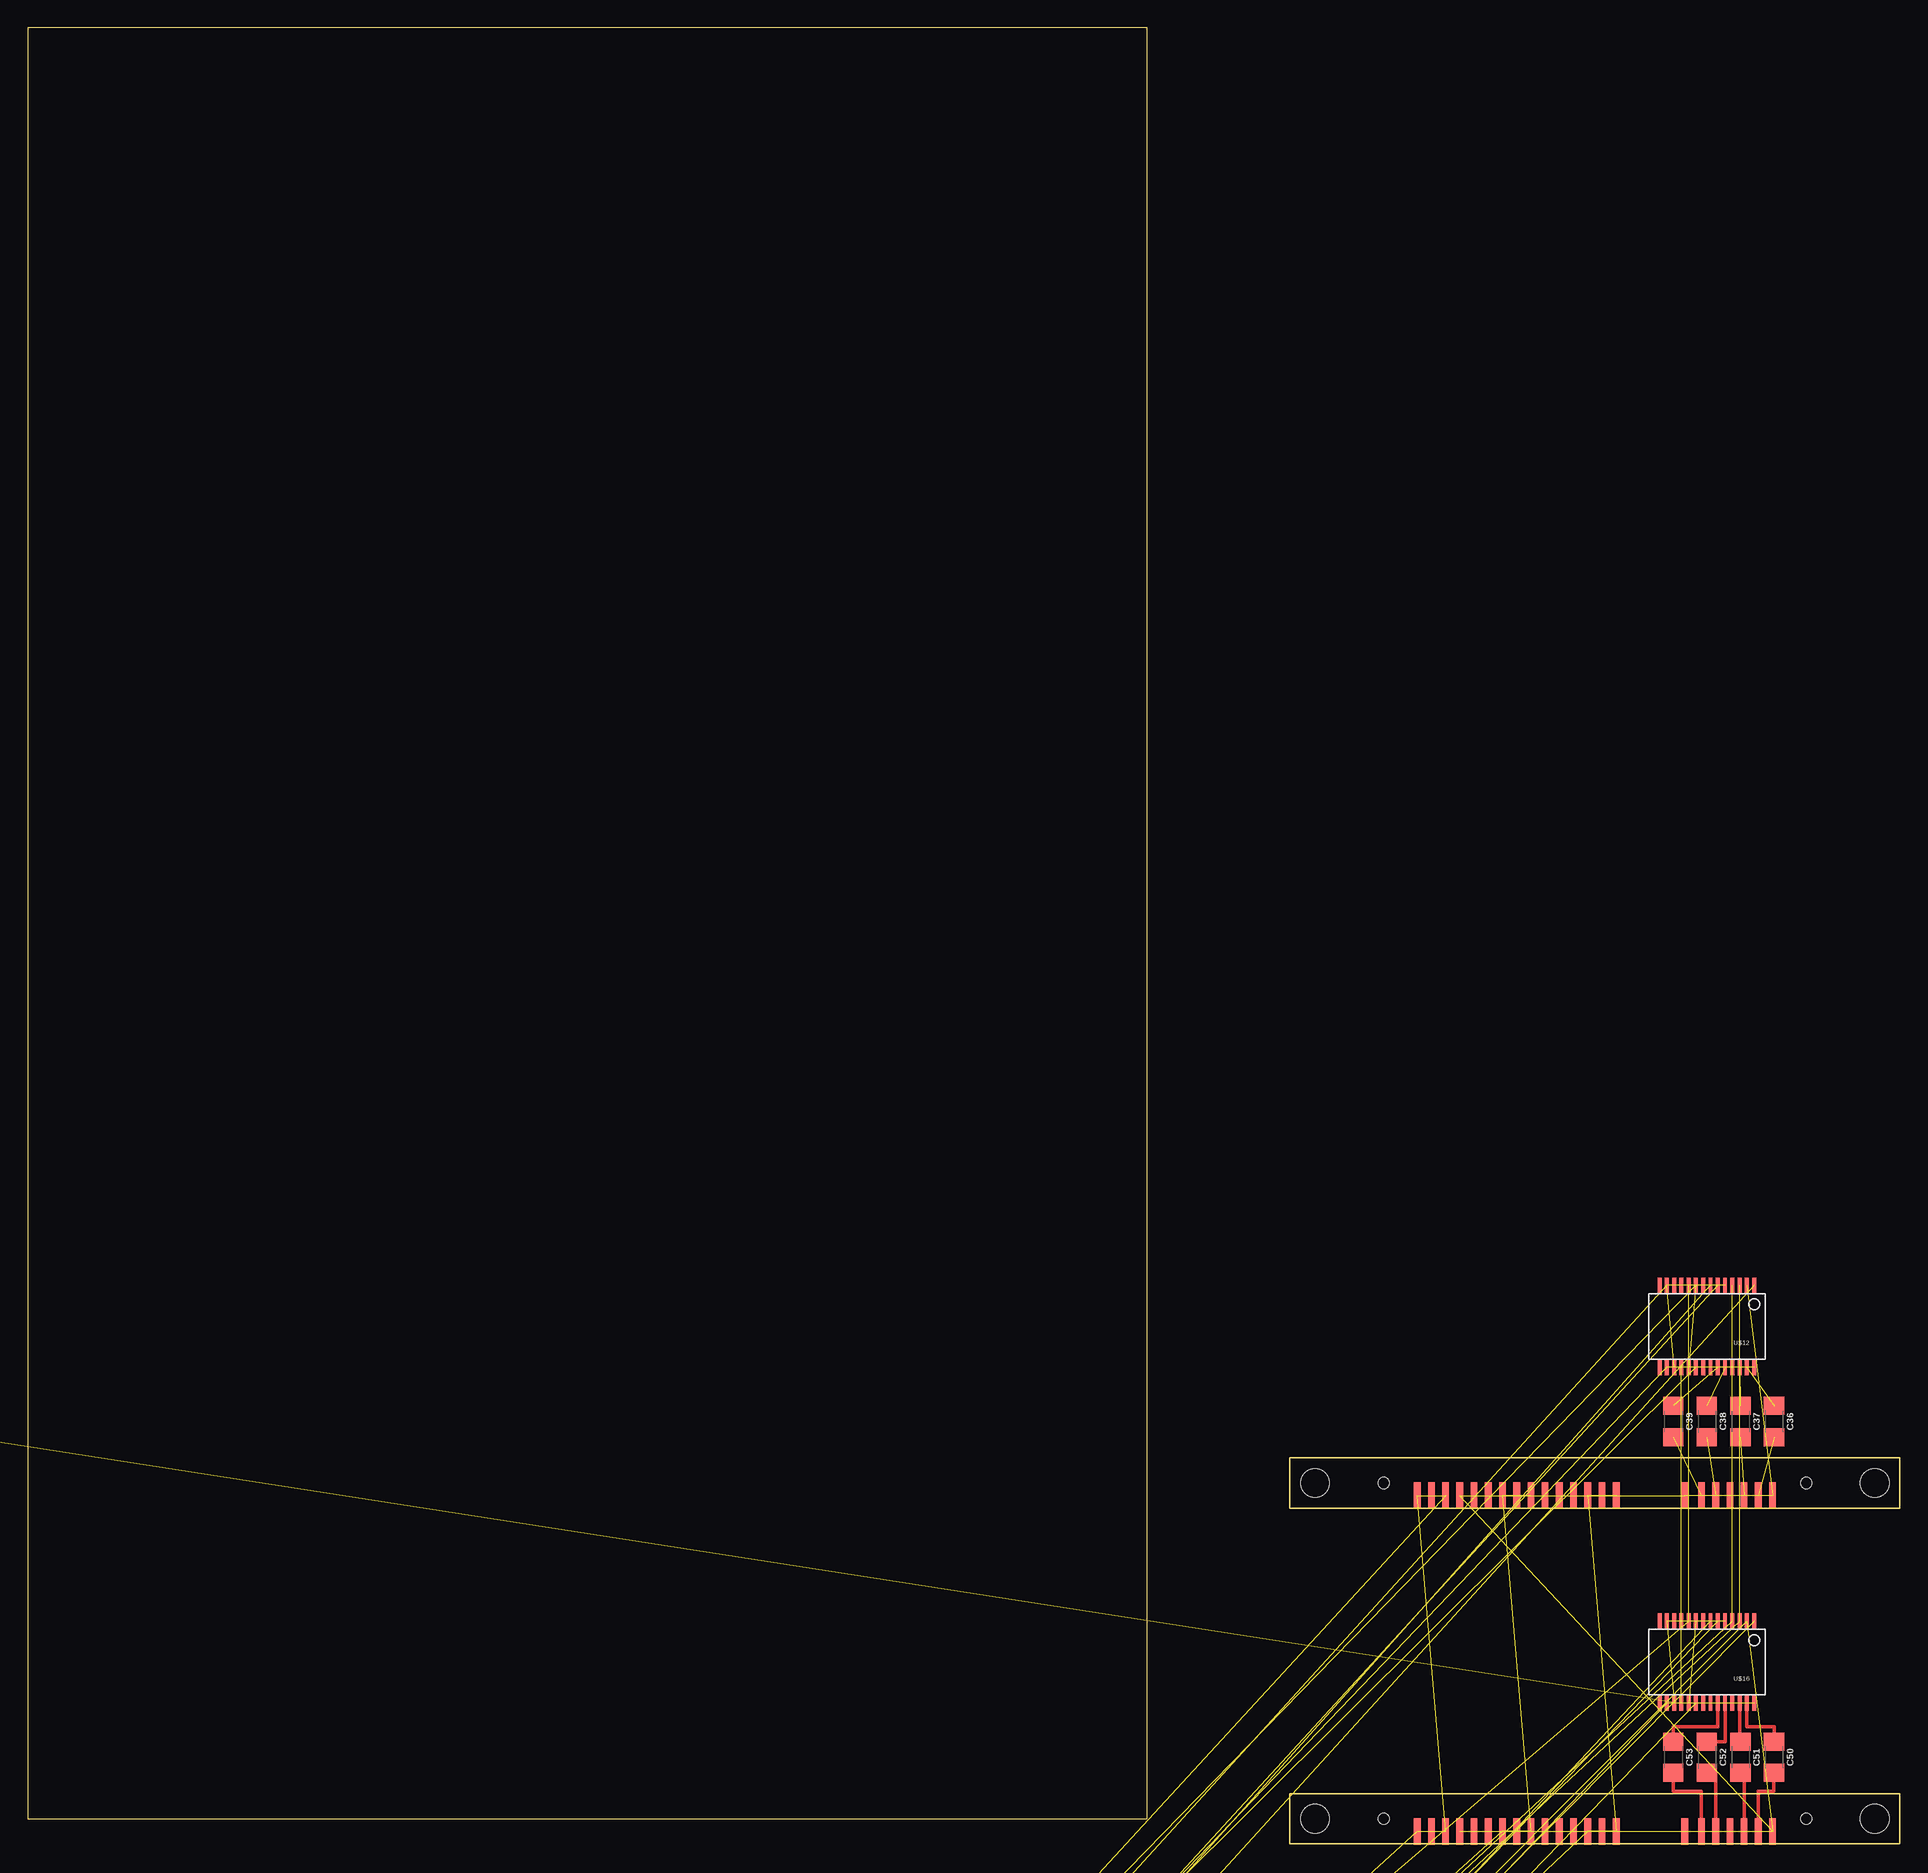
[diagram p4: board, top side]
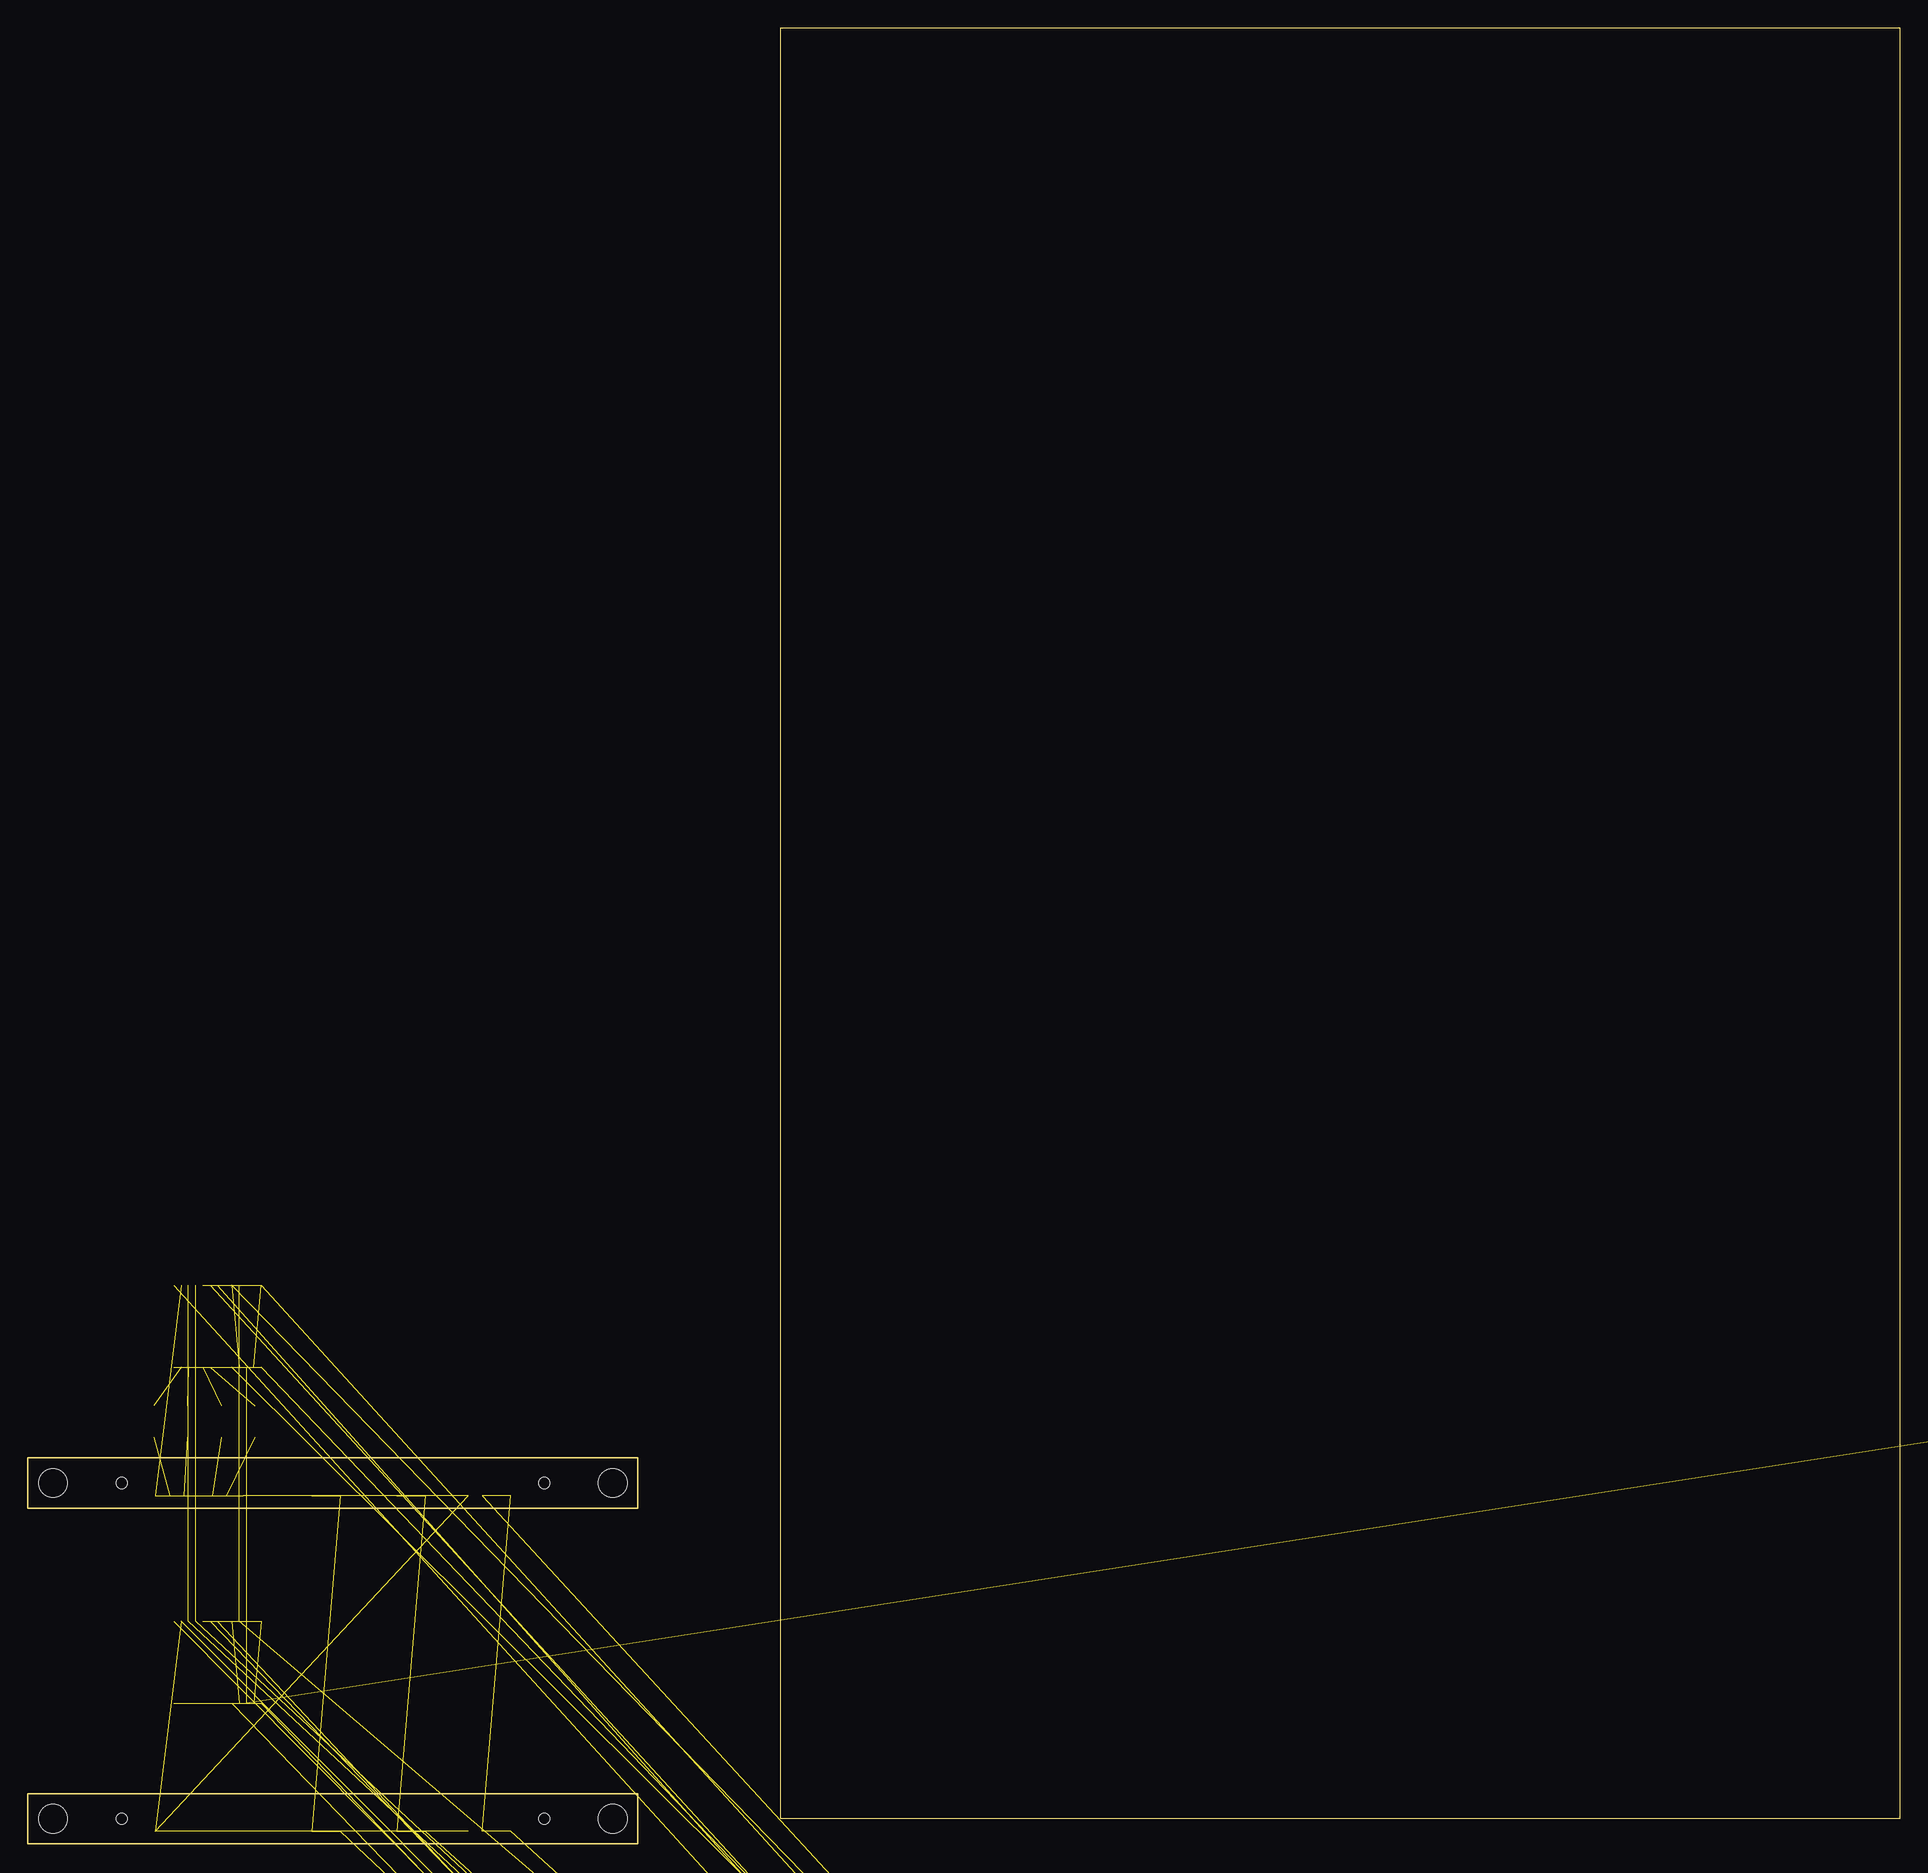
[diagram p5: board, bottom side, seen from below]

Size 167.25 x 162.25 mm. Coordinates in mm from the lower left corner, seen from the top.
Outline: 0,2.25 100,2.25 100,162.25 0,162.25 0,2.25
Copper layers (1*16): Top 0.035mm / dielectric 1.5mm / Bottom 0.035mm
Design rules "default": minimum track width 6mil, minimum drill 0.35mm, track to track 6mil, track to pad 6mil, pad to pad 6mil, via to via 6mil, smd to smd 6mil, copper to edge 40mil, drill to drill 6mil, minimum pad ring 10mil, minimum via ring 8mil, stop-mask expansion 4mil, vias tented up to drill 0mil, thermal gap 10mil

### Footprints (pad centres in the part's own frame; a part is rotated, then mirrored left to right if it is on the bottom)
1206 = smd 1.6 x 1.8: 1 -1.4,0; 2 1.4,0
CPOL-RADIAL-5MM-10MM = drill 0.9 pad 1.93 square: + 2.5,0 | drill 0.9 pad 1.93: - -2.5,0
EIA3216 = smd 1.4 x 1.6: + 1.4,0; - -1.4,0
2X20 = drill 1.016 pad 1.88: 1 0,0; 2 0,2.54; 3 2.54,0; 4 2.54,2.54; 5 5.08,0; 6 5.08,2.54; 7 7.62,0; 8 7.62,2.54; 9 10.16,0; 10 10.16,2.54; 11 12.7,0; 12 12.7,2.54; 13 15.24,0; 14 15.24,2.54; 15 17.78,0; 16 17.78,2.54; 17 20.32,0; 18 20.32,2.54; 19 22.86,0; 20 22.86,2.54; 21 25.4,0; 22 25.4,2.54; 23 27.94,0; 24 27.94,2.54; 25 30.48,0; 26 30.48,2.54; 27 33.02,0; 28 33.02,2.54; 29 35.56,0; 30 35.56,2.54; 31 38.1,0; 32 38.1,2.54; 33 40.64,0; 34 40.64,2.54; 35 43.18,0; 36 43.18,2.54; 37 45.72,0; 38 45.72,2.54; 39 48.26,0; 40 48.26,2.54
SHORT_TOP-50 = smd 1.27 x 1.27: 1 0.635,0; 2 -0.635,0
PAD.02X.02 = smd 0.508 x 0.508: P$1 0,0
1-1376408-4 = smd 0.35 x 2: 1 -32.65,-4.1; 2 -32.35,4.1; 3 -32.05,-4.1; 4 -31.75,4.1; 5 -31.45,-4.1; 6 -31.15,4.1; 7 -30.85,-4.1; 8 -30.55,4.1; 9 -30.25,-4.1; 10 -29.95,4.1; 11 -29.65,-4.1; 12 -29.35,4.1; 13 -29.05,-4.1; 14 -28.75,4.1; 15 -28.45,-4.1; 16 -28.15,4.1; 17 -27.85,-4.1; 18 -27.55,4.1; 19 -27.25,-4.1; 20 -26.95,4.1; 21 -26.65,-4.1; 22 -26.35,4.1; 23 -26.05,-4.1; 24 -25.75,4.1; 25 -25.45,-4.1; 26 -25.15,4.1; 27 -24.85,-4.1; 28 -24.55,4.1; 29 -24.25,-4.1; 30 -23.95,4.1; 31 -23.65,-4.1; 32 -23.35,4.1; 33 -23.05,-4.1; 34 -22.75,4.1; 35 -22.45,-4.1; 36 -22.15,4.1; 37 -21.85,-4.1; 38 -21.55,4.1; 39 -21.25,-4.1; 40 -20.95,4.1; 41 -17.05,-4.1; 42 -16.75,4.1; 43 -16.45,-4.1; 44 -16.15,4.1; 45 -15.85,-4.1; 46 -15.55,4.1; 47 -15.25,-4.1; 48 -14.95,4.1; 49 -14.65,-4.1; 50 -14.35,4.1; 51 -14.05,-4.1; 52 -13.75,4.1; 53 -13.45,-4.1; 54 -13.15,4.1; 55 -12.85,-4.1; 56 -12.55,4.1; 57 -12.25,-4.1; 58 -11.95,4.1; 59 -11.65,-4.1; 60 -11.35,4.1; 61 -11.05,-4.1; 62 -10.75,4.1; 63 -10.45,-4.1; 64 -10.15,4.1; 65 -9.85,-4.1; 66 -9.55,4.1; 67 -9.25,-4.1; 68 -8.95,4.1; 69 -8.65,-4.1; 70 -8.35,4.1; 71 -8.05,-4.1; 72 -7.75,4.1; 73 -7.45,-4.1; 74 -7.15,4.1; 75 -6.85,-4.1; 76 -6.55,4.1; 77 -6.25,-4.1; 78 -5.95,4.1; 79 -5.65,-4.1; 80 -5.35,4.1; 81 -5.05,-4.1; 82 -4.75,4.1; 83 -4.45,-4.1; 84 -4.15,4.1; 85 -3.85,-4.1; 86 -3.55,4.1; 87 -3.25,-4.1; 88 -2.95,4.1; 89 -2.65,-4.1; 90 -2.35,4.1; 91 -2.05,-4.1; 92 -1.75,4.1; 93 -1.45,-4.1; 94 -1.15,4.1; 95 -0.85,-4.1; 96 -0.55,4.1; 97 -0.25,-4.1; 98 0.05,4.1; 99 0.35,-4.1; 100 0.65,4.1; 101 0.95,-4.1; 102 1.25,4.1; 103 1.55,-4.1; 104 1.85,4.1; 105 2.15,-4.1; 106 2.45,4.1; 107 2.75,-4.1; 108 3.05,4.1; 109 3.35,-4.1; 110 3.65,4.1; 111 3.95,-4.1; 112 4.25,4.1; 113 4.55,-4.1; 114 4.85,4.1; 115 5.15,-4.1; 116 5.45,4.1; 117 5.75,-4.1; 118 6.05,4.1; 119 6.35,-4.1; 120 6.65,4.1; 121 6.95,-4.1; 122 7.25,4.1; 123 7.55,-4.1; 124 7.85,4.1; 125 8.15,-4.1; 126 8.45,4.1; 127 8.75,-4.1; 128 9.05,4.1; 129 9.35,-4.1; 130 9.65,4.1; 131 9.95,-4.1; 132 10.25,4.1; 133 10.55,-4.1; 134 10.85,4.1; 135 11.15,-4.1; 136 11.45,4.1; 137 11.75,-4.1; 138 12.05,4.1; 139 12.35,-4.1; 140 12.65,4.1; 141 12.95,-4.1; 142 13.25,4.1; 143 13.55,-4.1; 144 13.85,4.1; 145 14.15,-4.1; 146 14.45,4.1; 147 14.75,-4.1; 148 15.05,4.1; 149 15.35,-4.1; 150 15.65,4.1; 151 15.95,-4.1; 152 16.25,4.1; 153 16.55,-4.1; 154 16.85,4.1; 155 17.15,-4.1; 156 17.45,4.1; 157 17.75,-4.1; 158 18.05,4.1; 159 18.35,-4.1; 160 18.65,4.1; 161 18.95,-4.1; 162 19.25,4.1; 163 19.55,-4.1; 164 19.85,4.1; 165 20.15,-4.1; 166 20.45,4.1; 167 20.75,-4.1; 168 21.05,4.1; 169 21.35,-4.1; 170 21.65,4.1; 171 21.95,-4.1; 172 22.25,4.1; 173 22.55,-4.1; 174 22.85,4.1; 175 23.15,-4.1; 176 23.45,4.1; 177 23.75,-4.1; 178 24.05,4.1; 179 24.35,-4.1; 180 24.65,4.1; 181 24.95,-4.1; 182 25.25,4.1; 183 25.55,-4.1; 184 25.85,4.1; 185 26.15,-4.1; 186 26.45,4.1; 187 26.75,-4.1; 188 27.05,4.1; 189 27.35,-4.1; 190 27.65,4.1; 191 27.95,-4.1; 192 28.25,4.1; 193 28.55,-4.1; 194 28.85,4.1; 195 29.15,-4.1; 196 29.45,4.1; 197 29.75,-4.1; 198 30.05,4.1; 199 30.35,-4.1; 200 30.65,4.1 | smd 4.5 x 4.6: M1 -33.55,12; M2 31.55,12 | hole 1.45: -34.4,0 | hole 0.95: 32.4,0
Q5-DD_SPX29300 = smd 1 x 3.4: 1 -3.4,-7.875; 2 -1.7,-7.875; 3 0,-7.875; 4 1.7,-7.875; 5 3.4,-7.875 | smd 10.414 x 9.525: 6 0,1.595
SOT230P700X180-4N = smd 1.626 x 0.889: 1 -3.2,2.311; 2 -3.2,0; 3 -3.2,-2.311 | smd 1.626 x 3.175: 4 3.2,0
SSOP28DB = smd 0.348 x 1.397: 1 -4.225,-3.656; 2 -3.575,-3.656; 3 -2.925,-3.656; 4 -2.275,-3.656; 5 -1.625,-3.656; 6 -0.975,-3.656; 7 -0.325,-3.656; 8 0.325,-3.656; 9 0.975,-3.656; 10 1.625,-3.656; 11 2.275,-3.656; 12 2.925,-3.656; 13 3.575,-3.656; 14 4.225,-3.656; 15 4.225,3.656; 16 3.575,3.656; 17 2.925,3.656; 18 2.275,3.656; 19 1.625,3.656; 20 0.975,3.656; 21 0.325,3.656; 22 -0.325,3.656; 23 -0.975,3.656; 24 -1.625,3.656; 25 -2.275,3.656; 26 -2.925,3.656; 27 -3.575,3.656; 28 -4.225,3.656
3M-SATA-5622-1200-ML = smd 0.6 x 2.35: P$1 40.87,-1.125; P$2 39.6,-1.125; P$3 38.33,-1.125; P$4 37.06,-1.125; P$5 35.79,-1.125; P$6 34.52,-1.125; P$7 33.02,-1.125; P$8 26.9,-1.125; P$9 25.63,-1.125; P$10 24.36,-1.125; P$11 23.09,-1.125; P$12 21.82,-1.125; P$13 20.55,-1.125; P$14 19.28,-1.125; P$15 18.01,-1.125; P$16 16.74,-1.125; P$17 15.47,-1.125; P$18 14.2,-1.125; P$19 12.93,-1.125; P$20 11.66,-1.125; P$21 10.39,-1.125; P$22 9.12,-1.125 | hole 2.55: 0,0; 50,0 | hole 1: 43.875,0; 6.125,0
FE1.1S_SSOP-28 = smd 0.35 x 1.5: 1 -4.16,-2.7; 2 -3.52,-2.7; 3 -2.88,-2.7; 4 -2.24,-2.7; 5 -1.6,-2.7; 6 -0.96,-2.7; 7 -0.32,-2.7; 8 0.32,-2.7; 9 0.96,-2.7; 10 1.6,-2.7; 11 2.24,-2.7; 12 2.88,-2.7; 13 3.52,-2.7; 14 4.16,-2.7; 15 4.16,2.7; 16 3.52,2.7; 17 2.88,2.7; 18 2.24,2.7; 19 1.6,2.7; 20 0.96,2.7; 21 0.32,2.7; 22 -0.3,2.7; 23 -0.96,2.7; 24 -1.6,2.7; 25 -2.24,2.7; 26 -2.88,2.7; 27 -3.52,2.7; 28 -4.16,2.7
CRYSTAL-SMD-5X3.2-4PAD = smd 1.9 x 1.1: 1 -1.85,-1.15; 2 1.85,-1.15; 3 1.85,1.15; 4 -1.85,1.15

### Placement (x,y rotation side)
C1  -99.06,6.06 0 top  (outside the outline)
C2  -104.14,6.06 0 top  (outside the outline)
C3  -104.14,-21.88 0 top  (outside the outline)
C4  -99.06,-21.88 0 top  (outside the outline)
C5  -104.14,-48.55 0 top  (outside the outline)
C6  -99.06,-48.55 0 top  (outside the outline)
C7  -93.98,-61.25 0 top  (outside the outline)
C8  -93.98,-81.57 0 top  (outside the outline)
C9  -93.98,-101.89 0 top  (outside the outline)
C10  -93.98,-122.21 0 top  (outside the outline)
C11  -93.98,-142.53 0 top  (outside the outline)
C12  -93.98,-162.85 0 top  (outside the outline)
C13  -93.98,-183.17 0 top  (outside the outline)
C14  -104.14,-216.19 0 top  (outside the outline)
C15  -99.06,-216.19 0 top  (outside the outline)
C16  -119.38,-240.32 0 top  (outside the outline)
C17  -125.73,-246.67 0 top  (outside the outline)
C18  -132.08,-246.67 0 top  (outside the outline)
C19  -137.16,-245.4 0 top  (outside the outline)
C20  -142.24,-245.4 0 top  (outside the outline)
C21  -151.13,-268.26 0 top  (outside the outline)
C22  -144.78,-268.26 0 top  (outside the outline)
C23  -138.43,-268.26 0 top  (outside the outline)
C24  -138.43,-253.02 0 top  (outside the outline)
C25  -152.4,-261.91 0 top  (outside the outline)
C26  -151.13,-289.85 0 top  (outside the outline)
C27  -144.78,-289.85 0 top  (outside the outline)
C28  -138.43,-289.85 0 top  (outside the outline)
C29  -138.43,-274.61 0 top  (outside the outline)
C30  -152.4,-283.5 0 top  (outside the outline)
C31  -180.34,-311.44 0 top  (outside the outline)
C32  -195.58,-316.52 0 top  (outside the outline)
C33  -200.66,-316.52 0 top  (outside the outline)
C34  -205.74,-316.52 0 top  (outside the outline)
C35  -215.9,-316.52 0 top  (outside the outline)
C36  156,37.75 270 top
C37  153,37.75 270 top
C38  150,37.75 270 top
C39  147,37.75 270 top
C40  -241.3,-316.52 0 top  (outside the outline)
C41  -256.54,-316.52 0 top  (outside the outline)
C42  -261.62,-316.52 0 top  (outside the outline)
C43  -266.7,-316.52 0 top  (outside the outline)
C44  -271.78,-316.52 0 top  (outside the outline)
C45  -271.78,-354.62 0 top  (outside the outline)
C46  -266.7,-354.62 0 top  (outside the outline)
C47  -276.86,-380.02 0 top  (outside the outline)
C48  -276.86,-406.69 0 top  (outside the outline)
C49  -271.78,-406.69 0 top  (outside the outline)
C50  156,7.75 270 top
C51  153,7.75 270 top
C52  150,7.75 270 top
C53  147,7.75 270 top
J1  -38.66,41.9 90 top  (outside the outline)
R1  -88.9,6.06 0 top  (outside the outline)
R2  -93.98,6.06 0 top  (outside the outline)
R3  -93.98,-21.88 0 top  (outside the outline)
R4  -88.9,-21.88 0 top  (outside the outline)
R5  -93.98,-48.55 0 top  (outside the outline)
R6  -88.9,-48.55 0 top  (outside the outline)
R7  -109.22,-216.19 0 top  (outside the outline)
R8  -88.9,-216.19 0 top  (outside the outline)
R9  -114.3,-216.19 0 top  (outside the outline)
R10  -147.32,-245.4 0 top  (outside the outline)
R11  -152.4,-245.4 0 top  (outside the outline)
R12  -147.32,-261.91 0 top  (outside the outline)
R13  -147.32,-283.5 0 top  (outside the outline)
R14  -157.48,-288.58 0 top  (outside the outline)
R15  -175.26,-311.44 0 top  (outside the outline)
R16  -185.42,-316.52 0 top  (outside the outline)
R17  -190.5,-316.52 0 top  (outside the outline)
R18  -210.82,-316.52 0 top  (outside the outline)
R19  -246.38,-316.52 0 top  (outside the outline)
R20  -251.46,-316.52 0 top  (outside the outline)
R21  -261.62,-354.62 0 top  (outside the outline)
R22  -256.54,-354.62 0 top  (outside the outline)
R23  -276.86,-413.04 0 top  (outside the outline)
R24  -271.78,-413.04 0 top  (outside the outline)
R25  -266.7,-413.04 0 top  (outside the outline)
R26  -261.62,-413.04 0 top  (outside the outline)
SH1  -270.51,-321.6 0 top  (outside the outline)
SH2  -275.59,-418.12 0 top  (outside the outline)
TP_1.8V  -115.57,-220 0 top  (outside the outline)
TP_2.5V  -115.57,-225.08 0 top  (outside the outline)
TP_3.3V  -115.57,-222.54 0 top  (outside the outline)
TP_5.0V  -115.57,-227.62 0 top  (outside the outline)
TP_GND  -115.57,-232.7 0 top  (outside the outline)
TP_VCORE  -115.57,-230.16 0 top  (outside the outline)
U1  -49.53,74.64 90 top  (outside the outline)
U2  -49.53,21.3 0 top  (outside the outline)
U3  -88.9,-5.37 0 top  (outside the outline)
U4  -88.9,-32.04 0 top  (outside the outline)
U5  -88.9,-199.68 0 top  (outside the outline)
U6  -256.54,-338.11 0 top  (outside the outline)
U7  -266.7,-377.48 0 top  (outside the outline)
U$12  150,46.25 180 top
U$15  115,32.25 0 top
U$16  150,16.25 180 top
U$17  115,2.25 0 top
USB_A  -107.95,-239.05 0 top  (outside the outline)
USB_B  -146.05,-254.29 0 top  (outside the outline)
USB_C  -146.05,-275.88 0 top  (outside the outline)
Y1  -116.84,-246.67 0 top  (outside the outline)
Y2  -139.7,-261.91 0 top  (outside the outline)
Y3  -139.7,-283.5 0 top  (outside the outline)
Y4  -176.53,-317.79 0 top  (outside the outline)
Y5  -254,-413.04 0 top  (outside the outline)

### Tracks (layer width: path | path; a pad name or v marks a point on that pad's centre or on a via)
1.8V  (7 unrouted)
2.5V  (5 unrouted)
3.3V  (14 unrouted)
5V  (19 unrouted)
12V  (27 unrouted)
ADJUST  (2 unrouted)
ADJUST1  (2 unrouted)
ADJUST2  (2 unrouted)
ADJUST3  (2 unrouted)
ADJUST4  (2 unrouted)
GND  (148 unrouted)
GPIO_4  (1 unrouted)
GPIO_5  (1 unrouted)
GPIO_6  (1 unrouted)
GPIO_12  (1 unrouted)
GPIO_13  (1 unrouted)
GPIO_16  (1 unrouted)
GPIO_17  (1 unrouted)
GPIO_18  (1 unrouted)
GPIO_19  (1 unrouted)
GPIO_20  (1 unrouted)
GPIO_21  (1 unrouted)
GPIO_22  (1 unrouted)
GPIO_23  (1 unrouted)
GPIO_24  (1 unrouted)
GPIO_25  (1 unrouted)
GPIO_26  (1 unrouted)
GPIO_27  (1 unrouted)
HOST_USB_DM_N  (1 unrouted)
HOST_USB_DP_P  (1 unrouted)
N$1  (1 unrouted)
N$2  (1 unrouted)
N$3  (3 unrouted)
N$4  (7 unrouted)
N$5  (1 unrouted)
N$6  (1 unrouted)
N$7  (1 unrouted)
N$8  (1 unrouted)
N$9  (3 unrouted)
N$10  (7 unrouted)
N$11  (1 unrouted)
N$12  (1 unrouted)
N$13  (1 unrouted)
N$22  (1 unrouted)
N$23  (1 unrouted)
N$24  (3 unrouted)
N$25  (7 unrouted)
N$26  (1 unrouted)
N$27  (1 unrouted)
N$30  (1 unrouted)
N$31  (1 unrouted)
N$32  (1 unrouted)
N$33  (3 unrouted)
N$34  (2 unrouted)
N$35  (2 unrouted)
N$36  (1 unrouted)
N$40  (3 unrouted)
N$41  (2 unrouted)
N$42  (2 unrouted)
SATA_1_AGND  (11 unrouted)
SATA_1_CON_RXDN  (1 unrouted)
SATA_1_CON_RXDP  (1 unrouted)
SATA_1_CON_TXDN  (1 unrouted)
SATA_1_CON_TXDP  (1 unrouted)
SATA_1_IC_RXDN  (1 unrouted)
SATA_1_IC_RXDP  (1 unrouted)
SATA_1_IC_TXDN  (1 unrouted)
SATA_1_IC_TXDP  (1 unrouted)
SATA_1_VCC1.2D  (6 unrouted)
SATA_1_VCC3.3D  (7 unrouted)
SATA_2_AGND  (6 unrouted)
SATA_2_CON_RXDN
  Top 0.305: U$17.P$5 150.79,6.35 C52.2
SATA_2_CON_RXDP
  Top 0.305: U$17.P$6 149.52,4.7 147.01,4.7 147.01,6.35 C53.2
SATA_2_CON_TXDN
  Top 0.305: U$17.P$3 153.33,6.35 C51.2
SATA_2_CON_TXDP
  Top 0.305: U$17.P$2 154.6,4.7 155.99,4.7 155.99,6.35 C50.2
SATA_2_IC_RXDN
  Top 0.305: U$16.24 151.62,9.15 C52.1
SATA_2_IC_RXDP
  Top 0.305: U$16.23 150.97,10.45 147,10.45 C53.1
SATA_2_IC_TXDN
  Top 0.305: U$16.26 152.93,9.15 C51.1
SATA_2_IC_TXDP
  Top 0.305: U$16.27 153.57,10.45 156,10.45 C50.1
SATA_2_VCC1.2D  (3 unrouted)
SATA_2_VCC3.3D  (3 unrouted)
SATA_A_3.3V  (8 unrouted)
SATA_A_5V  (9 unrouted)
SCL1_I2C  (1 unrouted)
SDA1_I2C  (1 unrouted)
SPI0_MISO  (1 unrouted)
SPI0_MOSI  (1 unrouted)
SPI0_SCLK  (1 unrouted)
SPIO_CE0_N  (1 unrouted)
SPIO_CE1_N  (1 unrouted)
UART0_RXD  (1 unrouted)
UART0_TXD  (1 unrouted)
USB_A1_M  (1 unrouted)
USB_A1_P  (1 unrouted)
USB_A2_M  (1 unrouted)
USB_A2_P  (1 unrouted)
USB_B2_M  (3 unrouted)
USB_B2_P  (3 unrouted)
USB_VBUS  (3 unrouted)